# EAGLE design PCB_Plate_v6 (EAGLE 6.1)
REV: A

## Sheet 1 of 7
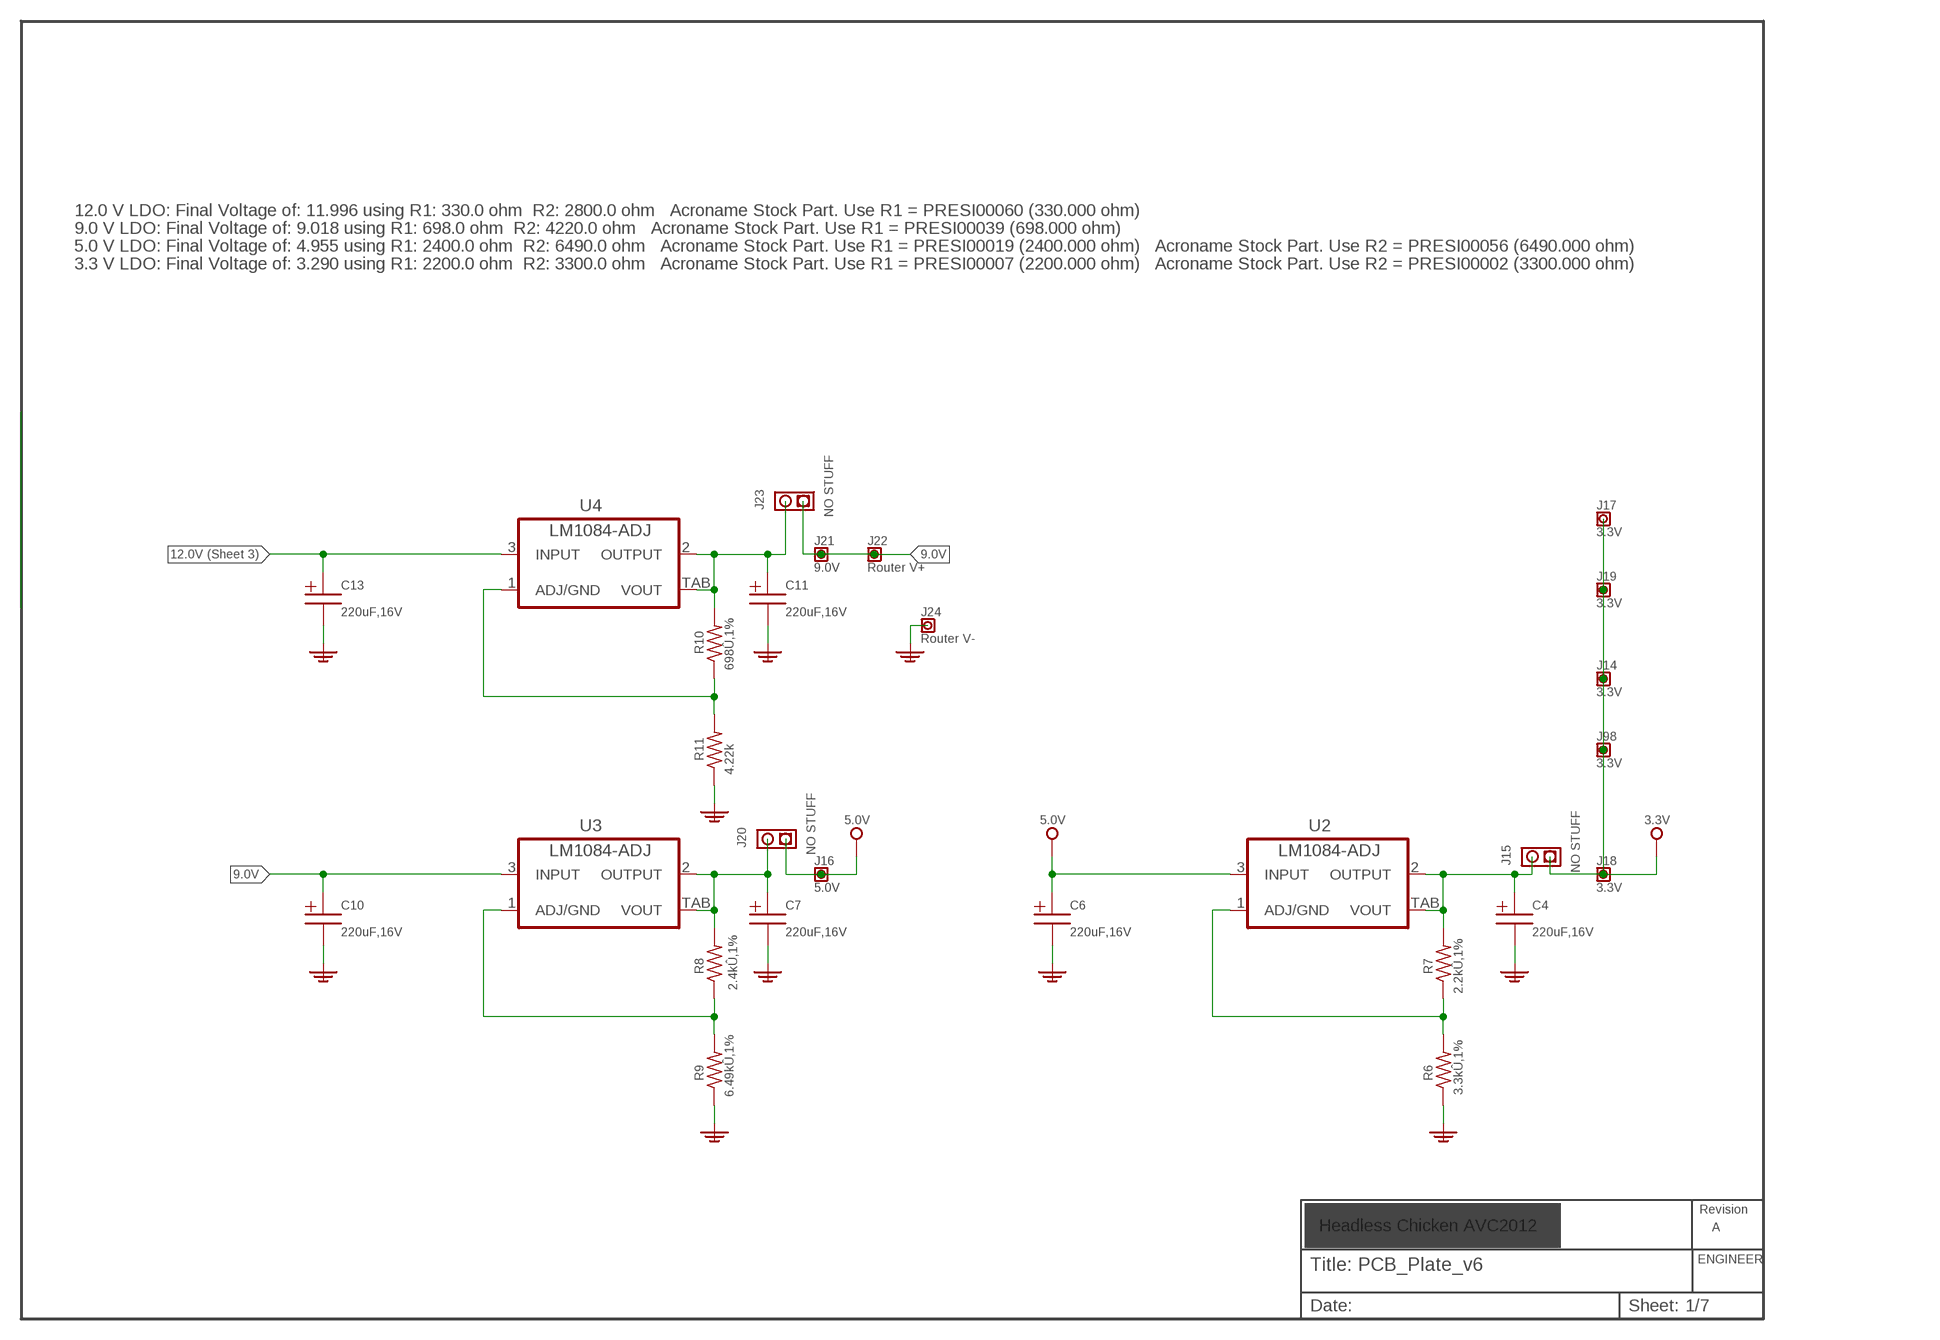
[diagram p0: schematic, sheet 1]

### Parts
C4  T491D227K016ZT  [SMC_D]
C6  T491D227K016ZT  [SMC_D]
C7  T491D227K016ZT  [SMC_D]
C10  T491D227K016ZT  [SMC_D]
C11  T491D227K016ZT  [SMC_D]
C13  T491D227K016ZT  [SMC_D]
J14  3.3V  BOARD00003WVALUE  [TSW1X1_VAL]
J15  BOARD00012  [TSW1X2]
J16  5.0V  BOARD00003WVALUE  [TSW1X1_VAL]
J17  3.3V  BOARD00003WVALUE  [TSW1X1_VAL]
J18  3.3V  BOARD00003WVALUE  [TSW1X1_VAL]
J19  3.3V  BOARD00003WVALUE  [TSW1X1_VAL]
J20  BOARD00012  [TSW1X2]
J21  9.0V  BOARD00003WVALUE  [TSW1X1_VAL]
J22  Router V+  BOARD00003WVALUE  [TSW1X1_VAL]
J23  BOARD00012  [TSW1X2]
J24  Router V-  BOARD00003WVALUE  [TSW1X1_VAL]
J98  3.3V  BOARD00003WVALUE  [TSW1X1_VAL]
R6  on  PRESI00002  [R0603]
R7  PRESI00007  [R0603]
R8  PRESI00019  [R0603]
R9  on  PRESI00056  [R0402]
R10  PRESI00039  [R0603]
R11  on  RESISTOR  [R0603]
U2  LM1084IS-ADJ  [TO263-3]
U3  LM1084IS-ADJ  [TO263-3]
U4  LM1084IS-ADJ  [TO263-3]

### Nets
3V3: J14.P$1 J15.P$1 J17.P$1 J18.P$1 J19.P$1 J98.P$1 ; also sheet 2,3,5,6,7
5V0: C6.+ J16.P$1 J20.P$1 U2.3(INPUT) ; also sheet 3,5
9.0V: C10.+ J21.P$1 J22.P$1 J23.P$1 U3.3(INPUT)
12.0V: C13.+ U4.3(INPUT) ; also sheet 3,4
GND: C4.- C6.- C7.- C10.- C11.- C13.- J24.P$1 R6.1 R9.1 R11.1 ; also sheet 2,3,4,5,6,7
N$1: R10.1 R11.2 U4.1(ADJ/GND)
N$6: R8.1 R9.2 U3.1(ADJ/GND)
N$7: R6.2 R7.1 U2.1(ADJ/GND)
N$106: C7.+ J20.P$2 R8.2 U3.2(OUTPUT) U3.TAB(VOUT)
N$107: C11.+ J23.P$2 R10.2 U4.2(OUTPUT) U4.TAB(VOUT)
N$109: C4.+ J15.P$2 R7.2 U2.2(OUTPUT) U2.TAB(VOUT)

### Notes on the sheet
- 12.0 V LDO: Final Voltage of: 11.996 using R1: 330.0 ohm  R2: 2800.0 ohm   Acroname Stock Part. Use R1 = PRESI00060 (330.000 ohm)
- 9.0 V LDO: Final Voltage of: 9.018 using R1: 698.0 ohm  R2: 4220.0 ohm   Acroname Stock Part. Use R1 = PRESI00039 (698.000 ohm)
- 5.0 V LDO: Final Voltage of: 4.955 using R1: 2400.0 ohm  R2: 6490.0 ohm   Acroname Stock Part. Use R1 = PRESI00019 (2400.000 ohm)   Acroname Stock Part. Use R2 = PRESI00056 (6490.000 ohm)
- 3.3 V LDO: Final Voltage of: 3.290 using R1: 2200.0 ohm  R2: 3300.0 ohm   Acroname Stock Part. Use R1 = PRESI00007 (2200.000 ohm)   Acroname Stock Part. Use R2 = PRESI00002 (3300.000 ohm)
- Headless Chicken AVC2012 | Headless Chicken AVC2012

## Sheet 2 of 7
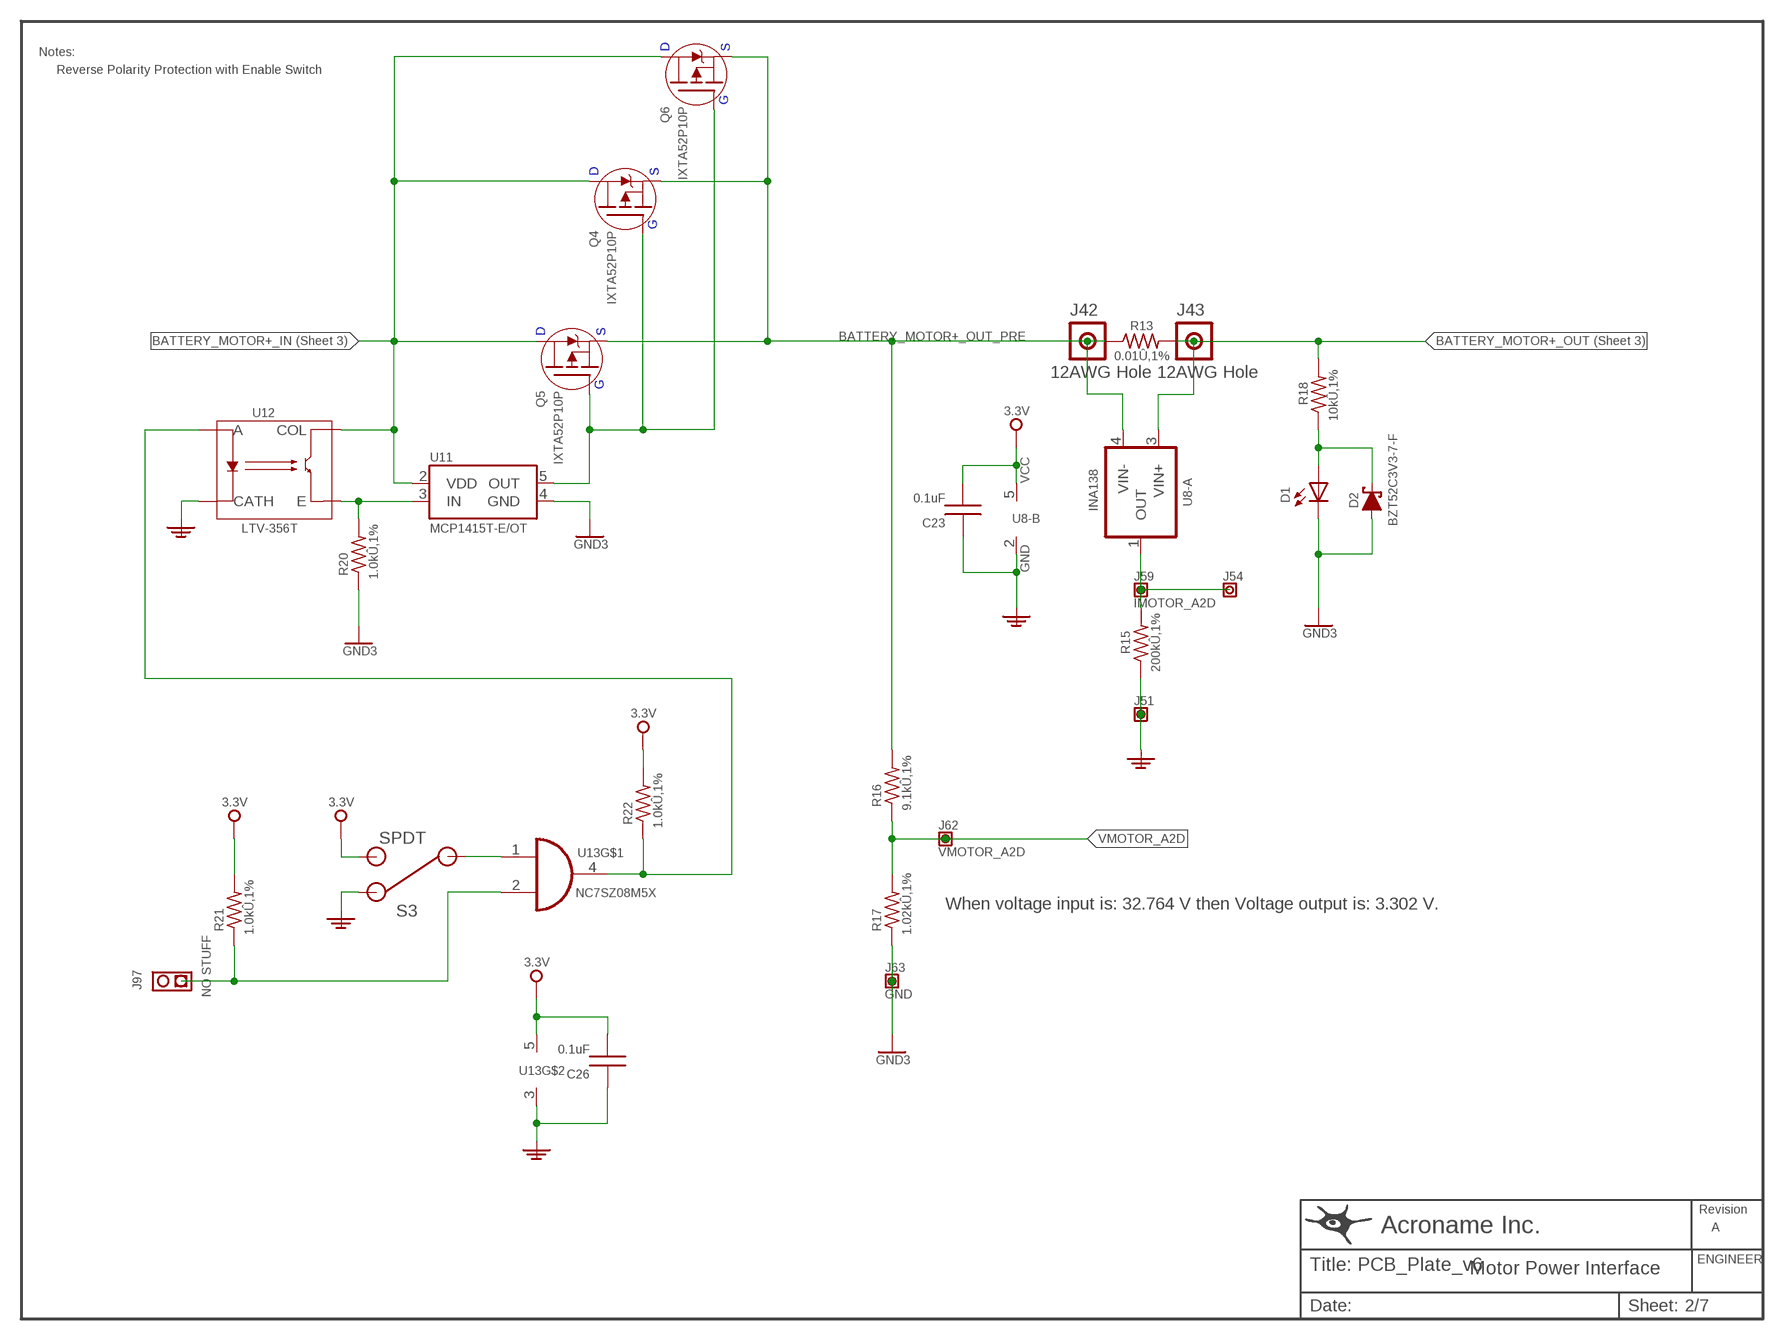
[diagram p1: schematic, sheet 2]

### Parts
C23  PCAPI00015  [C0603]
C26  PCAPI00015  [C0603]
D1  PDIOD00001  [CHIPLED_0805]
D2  BZT52C3V3-7-F  [SOD123]
J42  BOARD00008  [TSW1X1_12AWG]
J43  BOARD00008  [TSW1X1_12AWG]
J51  BOARD00003WVALUE  [TSW1X1_VAL]
J54  BOARD00003WVALUE  [TSW1X1_VAL]
J59  IMOTOR_A2D  BOARD00003WVALUE  [TSW1X1_VAL]
J62  VMOTOR_A2D  BOARD00003WVALUE  [TSW1X1_VAL]
J63  GND  BOARD00003WVALUE  [TSW1X1_VAL]
J97  BOARD00012  [TSW1X2]
Q4  IXTA52P10P  [D2PACK]
Q5  IXTA52P10P  [D2PACK]
Q6  IXTA52P10P  [D2PACK]
R13  PRESI00041  [R4527]
R15  PRESI00018  [R0603]
R16  ERJ-2RKF9101X  [R0402@1]
R17  ERJ-2RKF1021X  [R0402@1]
R18  PRESI00005  [R0603]
R20  PRESI00006  [R0603]
R21  PRESI00006  [R0603]
R22  PRESI00006  [R0603]
S3  PMISC00005  [SPDTRA]
U8  PCHIP00026  [SOT23-5]
U11  MCP1416  [SOT23-5]
U12  LTV-356T  [4-SMD]
U13  NC7SZ08M5X  [SOT23-5]

### Nets
3V3: C23.2 C26.2 R21.2 R22.2 S3.3 U8.5(-B:VCC) U13.5(VCC) ; also sheet 1,3,5,6,7
BATTERY_MOTOR+_IN: Q4.D Q5.D Q6.D U11.2(VDD) U12.4(COL) ; also sheet 3
BATTERY_MOTOR+_OUT: J43.P$1 R13.2 R18.2 U8.3(-A:VIN+) ; also sheet 3
BATTERY_MOTOR+_OUT_PRE: J42.P$1 Q4.S Q5.S Q6.S R13.1 R16.2 U8.4(-A:VIN-)
GND: C23.1 C26.1 J51.P$1 R15.1 S3.1 U8.2(-B:GND) U12.2(CATH) U13.3(GND) ; also sheet 1,3,4,5,6,7
GND3: D1.C D2.C(A) J63.P$1 R17.1 R20.1 U11.4(GND) ; also sheet 3
IMOTOR_A2D: J54.P$1 J59.P$1 R15.2 U8.1(-A:OUT)
N$3: Q4.G Q5.G Q6.G U11.5(OUT)
N$4: D1.A D2.A(C) R18.1
N$5: R22.1 U12.1(A) U13.4(O)
N$8: S3.2 U13.1(I0)
N$78: J97.P$1 R21.1 U13.2(I1)
N$79: R20.2 U11.3(IN) U12.3(E)
VMOTOR_A2D: J62.P$1 R16.1 R17.2
Unconnected: J97.P$2 S3.4 S3.5 U11.1

### Notes on the sheet
- Notes:
- Reverse Polarity Protection with Enable Switch
- When voltage input is: 32.764 V then Voltage output is: 3.302 V.
- Motor Power Interface

## Sheet 3 of 7
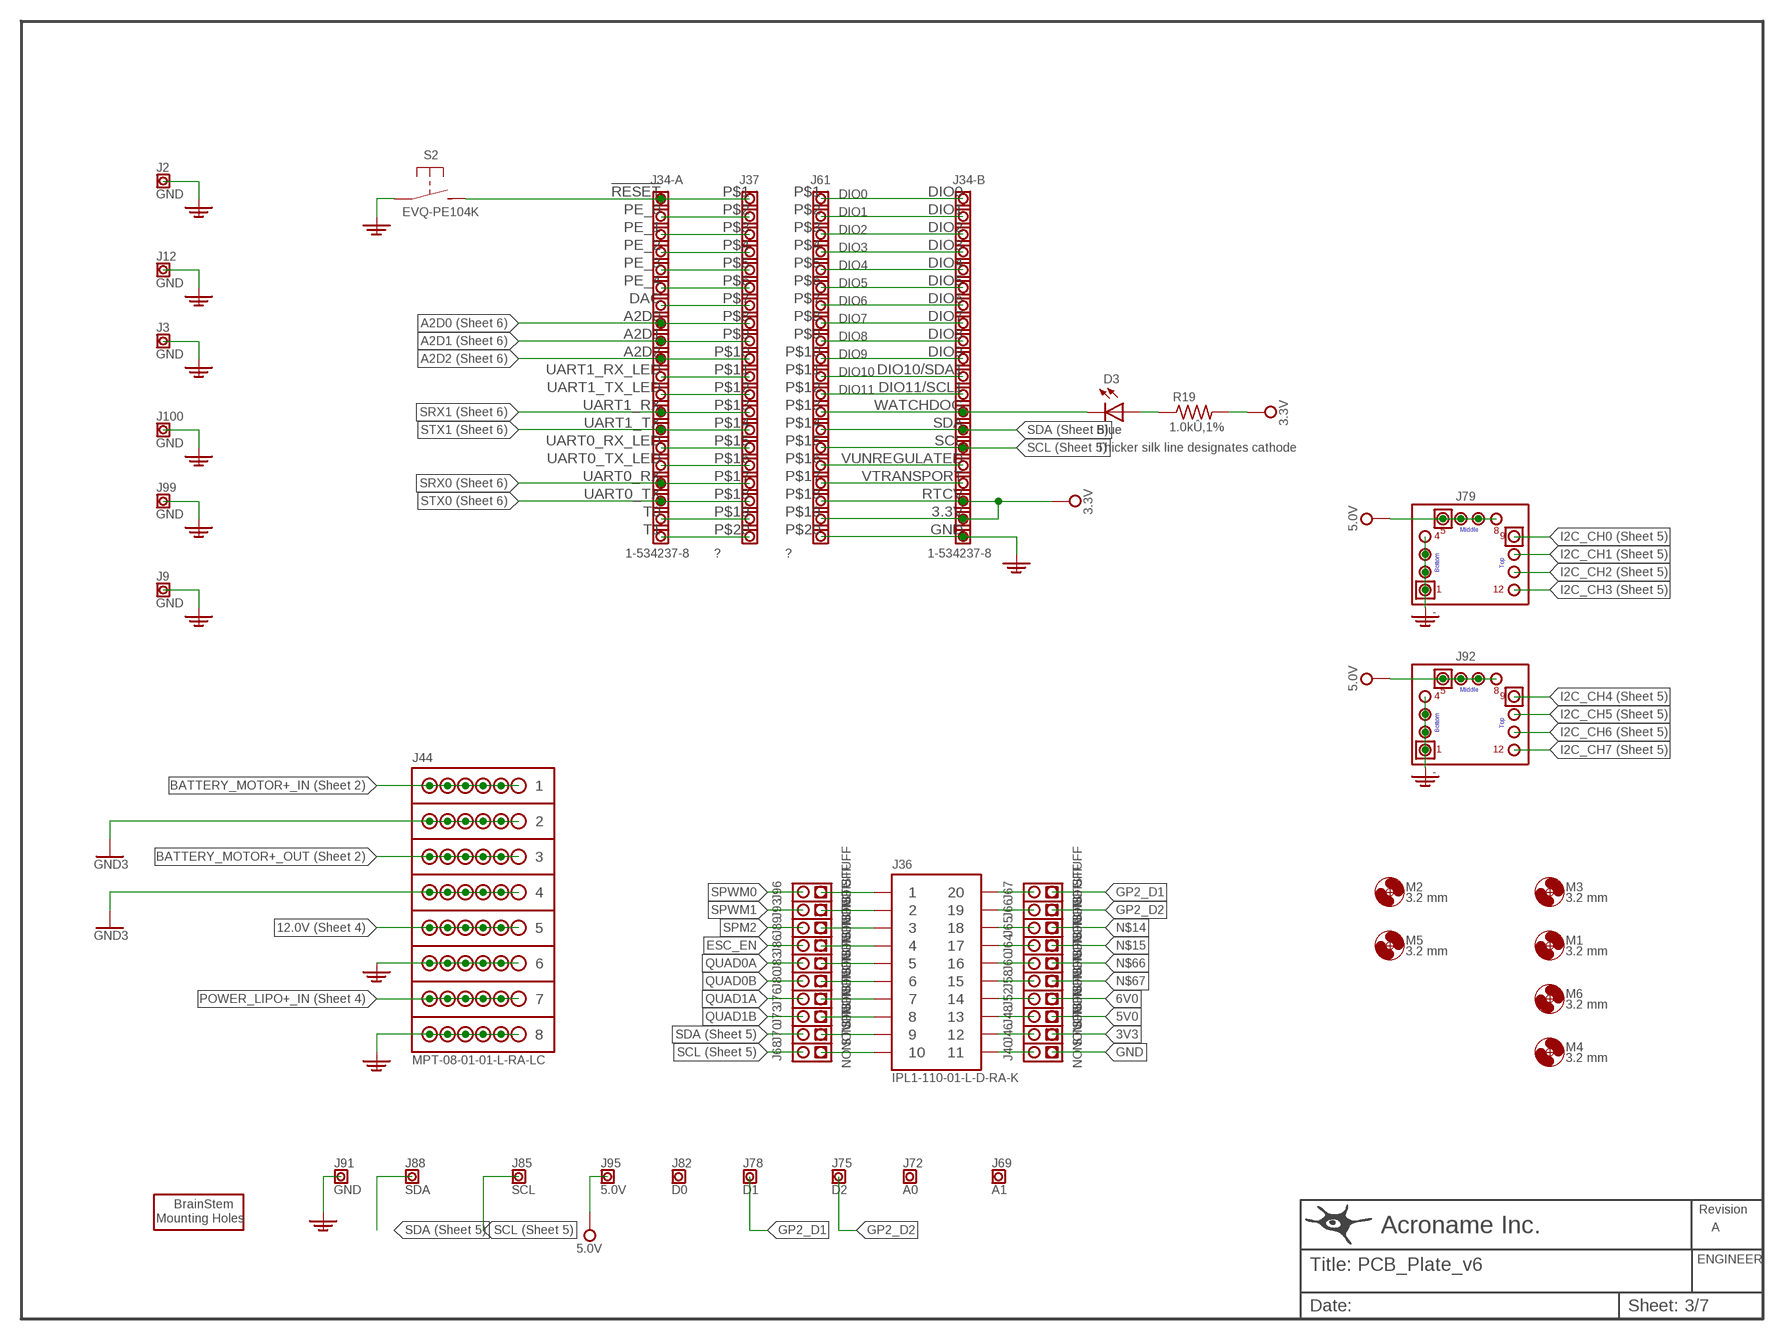
[diagram p2: schematic, sheet 3]

### Parts
D3  LTST-C171TBKT  [CHIPLED_0805]
J2  GND  BOARD00003WVALUE  [TSW1X1_VAL]
J3  GND  BOARD00003WVALUE  [TSW1X1_VAL]
J9  GND  BOARD00003WVALUE  [TSW1X1_VAL]
J12  GND  BOARD00003WVALUE  [TSW1X1_VAL]
J34  BRAINSTEMSOCKET_FEMALE  [BRAINSTEMSOCKET]
J36  IPL1-1XX-02-XXX-DH-K-XX-MKT  [IPL1-110-01-S-RA]
J37  TSW1X20  [TSW1X20]
J40  BOARD00012  [TSW1X2]
J44  MPT-08-01-01-L-RA-LC  [MPT-08-XX-X-RA-XX]
J46  BOARD00012  [TSW1X2]
J48  BOARD00012  [TSW1X2]
J52  BOARD00012  [TSW1X2]
J58  BOARD00012  [TSW1X2]
J60  BOARD00012  [TSW1X2]
J61  TSW1X20  [TSW1X20]
J64  BOARD00012  [TSW1X2]
J65  BOARD00012  [TSW1X2]
J66  BOARD00012  [TSW1X2]
J67  BOARD00012  [TSW1X2]
J68  BOARD00012  [TSW1X2]
J69  A1  BOARD00003WVALUE  [TSW1X1_VAL]
J70  BOARD00012  [TSW1X2]
J72  A0  BOARD00003WVALUE  [TSW1X1_VAL]
J73  BOARD00012  [TSW1X2]
J75  D2  BOARD00003WVALUE  [TSW1X1_VAL]
J76  BOARD00012  [TSW1X2]
J78  D1  BOARD00003WVALUE  [TSW1X1_VAL]
J79  PCONN00012  [TSW3X4RA]
J80  BOARD00012  [TSW1X2]
J82  D0  BOARD00003WVALUE  [TSW1X1_VAL]
J83  BOARD00012  [TSW1X2]
J85  SCL  BOARD00003WVALUE  [TSW1X1_VAL]
J86  BOARD00012  [TSW1X2]
J88  SDA  BOARD00003WVALUE  [TSW1X1_VAL]
J89  BOARD00012  [TSW1X2]
J91  GND  BOARD00003WVALUE  [TSW1X1_VAL]
J92  PCONN00012  [TSW3X4RA]
J93  BOARD00012  [TSW1X2]
J95  5.0V  BOARD00003WVALUE  [TSW1X1_VAL]
J96  BOARD00012  [TSW1X2]
J99  GND  BOARD00003WVALUE  [TSW1X1_VAL]
J100  GND  BOARD00003WVALUE  [TSW1X1_VAL]
M1  MOUNT-HOLE3.2  [3,2]
M2  MOUNT-HOLE3.2  [3,2]
M3  MOUNT-HOLE3.2  [3,2]
M4  MOUNT-HOLE3.2  [3,2]
M5  MOUNT-HOLE3.2  [3,2]
M6  MOUNT-HOLE3.2  [3,2]
M7  BRAINSTEM_MOUNT  [BRAINSTEM_MOUNT]
R19  PRESI00006  [R0603]
S2  EVQ-PE104K  [SPST-NO]

### Nets
3V3: J34.3.3V J34.RTCV J46.P$1 J61.P$18 J61.P$19 R19.2 ; also sheet 1,2,5,6,7
5V0: J48.P$1 J79.P$5 J79.P$6 J79.P$7 J79.P$8 J92.P$5 J92.P$6 J92.P$7 J92.P$8 J95.P$1 ; also sheet 1,5
6V0: J52.P$1
12.0V: J44.5@0 J44.5@1 J44.5@2 J44.5@3 J44.5@4 J44.5@5 ; also sheet 1,4
!RESET: J34.!RESET J37.P$1 S2.P$2(S)
A2D0: J34.A2D0 J37.P$8 ; also sheet 6
A2D1: J34.A2D1 J37.P$9 ; also sheet 6
A2D2: J34.A2D2 J37.P$10 ; also sheet 6
BATTERY_MOTOR+_IN: J44.1@0 J44.1@1 J44.1@2 J44.1@3 J44.1@4 J44.1@5 ; also sheet 2
BATTERY_MOTOR+_OUT: J44.3@0 J44.3@1 J44.3@2 J44.3@3 J44.3@4 J44.3@5 ; also sheet 2
DIO0: J34.DIO0 J61.P$1
DIO1: J34.DIO1 J61.P$2
DIO2: J34.DIO2 J61.P$3
DIO3: J34.DIO3 J61.P$4
DIO4: J34.DIO4 J61.P$5
DIO5: J34.DIO5 J61.P$6
DIO6: J34.DIO6 J61.P$7
DIO7: J34.DIO7 J61.P$8
DIO8: J34.DIO8 J61.P$9
DIO9: J34.DIO9 J61.P$10
DIO10: J34.DIO10/SDA1 J61.P$11
DIO11: J34.DIO11/SCL1 J61.P$12
ESC_EN: J86.P$2
GND: J2.P$1 J3.P$1 J9.P$1 J12.P$1 J34.GND J40.P$1 J44.6@0 J44.6@1 J44.6@2 J44.6@3 J44.6@4 J44.6@5 J44.8@0 J44.8@1 J44.8@2 J44.8@3 J44.8@4 J44.8@5 J61.P$20 J79.P$1 J79.P$2 J79.P$3 J79.P$4 J91.P$1 J92.P$1 J92.P$2 J92.P$3 J92.P$4 J99.P$1 J100.P$1 S2.P$1(P) ; also sheet 1,2,4,5,6,7
GND3: J44.2@0 J44.2@1 J44.2@2 J44.2@3 J44.2@4 J44.2@5 J44.4@0 J44.4@1 J44.4@2 J44.4@3 J44.4@4 J44.4@5 ; also sheet 2
GP2_D1: J67.P$1 J78.P$1
GP2_D2: J66.P$1 J75.P$1
I2C_CH0: J79.P$9 ; also sheet 5
I2C_CH1: J79.P$10 ; also sheet 5
I2C_CH2: J79.P$11 ; also sheet 5
I2C_CH3: J79.P$12 ; also sheet 5
I2C_CH4: J92.P$9 ; also sheet 5
I2C_CH5: J92.P$10 ; also sheet 5
I2C_CH6: J92.P$11 ; also sheet 5
I2C_CH7: J92.P$12 ; also sheet 5
N$9: D3.A R19.1
N$12: D3.C J34.WATCHDOG J61.P$13
N$14: J65.P$1
N$15: J64.P$1
N$16: J34.PE_0 J37.P$2
N$17: J34.PE_1 J37.P$3
N$18: J34.PE_2 J37.P$4
N$19: J34.PE_3 J37.P$5
N$20: J34.PE_4 J37.P$6
N$21: J34.DAC J37.P$7
N$22: J34.UART1_RX_LED J37.P$11
N$23: J34.UART1_TX_LED J37.P$12
N$26: J34.UART0_RX_LED J37.P$15
N$27: J34.UART0_TX_LED J37.P$16
N$30: J34.T0 J37.P$19
N$31: J34.T1 J37.P$20
N$44: J34.VTRANSPORT J61.P$17
N$46: J36.1 J96.P$1
N$56: J36.2 J93.P$1
N$57: J36.3 J89.P$1
N$59: J36.4 J86.P$1
N$60: J36.5 J83.P$1
N$61: J36.6 J80.P$1
N$62: J36.7 J76.P$1
N$63: J36.8 J73.P$1
N$64: J36.9 J70.P$1
N$65: J36.10 J68.P$1
N$66: J60.P$1
N$67: J58.P$1
N$68: J36.20 J67.P$2
N$69: J36.19 J66.P$2
N$70: J36.18 J65.P$2
N$71: J36.17 J64.P$2
N$72: J36.16 J60.P$2
N$73: J36.15 J58.P$2
N$74: J36.14 J52.P$2
N$75: J36.13 J48.P$2
N$76: J36.12 J46.P$2
N$77: J36.11 J40.P$2
N$80: J34.VUNREGULATED J61.P$16
POWER_LIPO+_IN: J44.7@0 J44.7@1 J44.7@2 J44.7@3 J44.7@4 J44.7@5 ; also sheet 4
QUAD0A: J83.P$2
QUAD0B: J80.P$2
QUAD1A: J76.P$2
QUAD1B: J73.P$2
SCL: J34.SCL J61.P$15 J68.P$2 J85.P$1 ; also sheet 5,6,7
SDA: J34.SDA J61.P$14 J70.P$2 J88.P$1 ; also sheet 5,6,7
SPM2: J89.P$2
SPWM0: J96.P$2
SPWM1: J93.P$2
SRX0: J34.UART0_RX J37.P$17 ; also sheet 6
SRX1: J34.UART1_RX J37.P$13 ; also sheet 6
STX0: J34.UART0_TX J37.P$18 ; also sheet 6
STX1: J34.UART1_TX J37.P$14 ; also sheet 6
Unconnected: J69.P$1 J72.P$1 J82.P$1

## Sheet 4 of 7
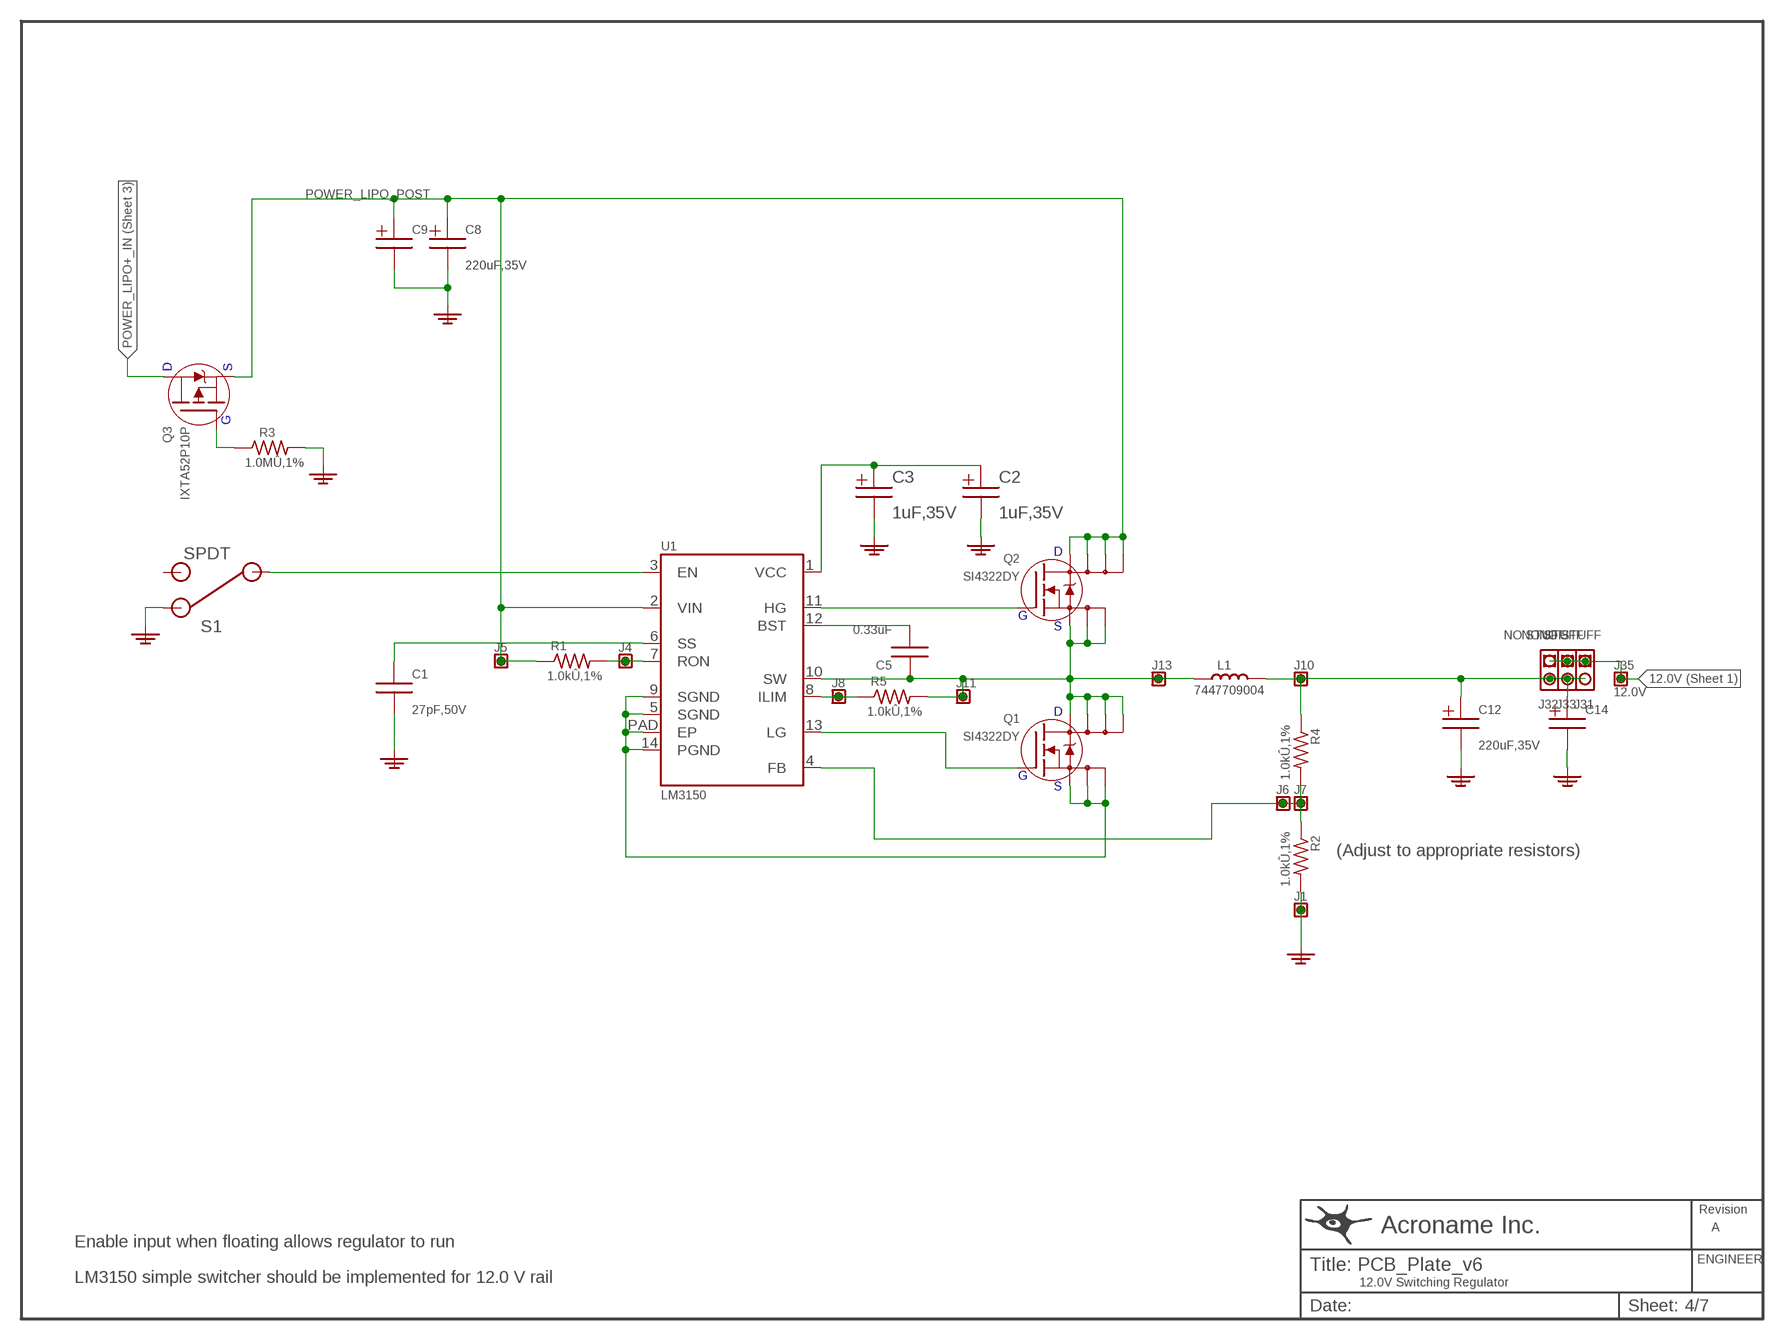
[diagram p3: schematic, sheet 4]
FRAME4 (LETTER_L): DESCRIPTION: 12.0V Switching Regulator

### Parts
C1  ECJ-1VC1H270J  [C0603]
C2  T491B105K035AT  [T491]
C3  T491B105K035AT  [T491]
C5  PCAPI00005  [C0603]
C8  PCAPI00020  [PANASONIC_G]
C9  CAP_POLARIZED  [PANASONIC_NHG_A]
C12  PCAPI00020  [PANASONIC_G]
C14  CAP_POLARIZED  [PANASONIC_NHG_A]
J1  BOARD00003  [TSW1X1]
J4  BOARD00003  [TSW1X1]
J5  BOARD00003  [TSW1X1]
J6  BOARD00003  [TSW1X1]
J7  BOARD00003  [TSW1X1]
J8  BOARD00003  [TSW1X1]
J10  BOARD00003  [TSW1X1]
J11  BOARD00003  [TSW1X1]
J13  BOARD00003  [TSW1X1]
J31  BOARD00012  [TSW1X2]
J32  BOARD00012  [TSW1X2]
J33  BOARD00012  [TSW1X2]
J35  12.0V  BOARD00003WVALUE  [TSW1X1_VAL]
L1  7447709004  [7447709004]
Q1  SI4322DY  [SO-08]
Q2  SI4322DY  [SO-08]
Q3  IXTA52P10P  [D2PACK]
R1  PRESI00006  [R0603]
R2  PRESI00006  [R0603]
R3  ERJ-3EKF1004V  [R0603]
R4  PRESI00006  [R0603]
R5  PRESI00006  [R0603]
S1  PMISC00005  [SPDTRA]
U1  LM3150  [TSSOP14EXP]

### Nets
12.0V: J31.P$1 J32.P$1 J33.P$1 J35.P$1 ; also sheet 1,3
GND: C1.2 C2.- C3.- C8.- C9.- C12.- C14.- J1.P$1 R2.2 R3.2 S1.1 ; also sheet 1,2,3,5,6,7
N$2: S1.2 U1.3(EN)
N$42: C12.+ C14.+ J10.P$1 J31.P$2 J32.P$2 J33.P$2 L1.2 R4.1
N$45: C2.+ C3.+ U1.1(VCC)
N$47: Q1.1(SA) Q1.2(SB) Q1.3(SC) U1.5(SGND) U1.9(SGND) U1.14(PGND) U1.PAD(EP)
N$48: Q1.4(G) U1.13(LG)
N$49: Q2.4(G) U1.11(HG)
N$50: Q3.G R3.1
N$51: J4.P$1 R1.2 U1.7(RON)
N$52: C5.1 J11.P$1 J13.P$1 L1.1 Q1.5(DA) Q1.6(DB) Q1.7(DC) Q1.8(DD) Q2.1(SA) Q2.2(SB) Q2.3(SC) R5.2 U1.10(SW)
N$53: C5.2 U1.12(BST)
N$54: J6.P$1 J7.P$1 R2.1 R4.2 U1.4(FB)
N$55: J8.P$1 R5.1 U1.8(ILIM)
N$58: C1.1 U1.6(SS)
POWER_LIPO+_IN: Q3.D ; also sheet 3
POWER_LIPO_POST: C8.+ C9.+ J5.P$1 Q2.5(DA) Q2.6(DB) Q2.7(DC) Q2.8(DD) Q3.S R1.1 U1.2(VIN)
Unconnected: S1.3 S1.4 S1.5

### Notes on the sheet
- (Adjust to appropriate resistors)
- Enable input when floating allows regulator to run
- LM3150 simple switcher should be implemented for 12.0 V rail

## Sheet 5 of 7
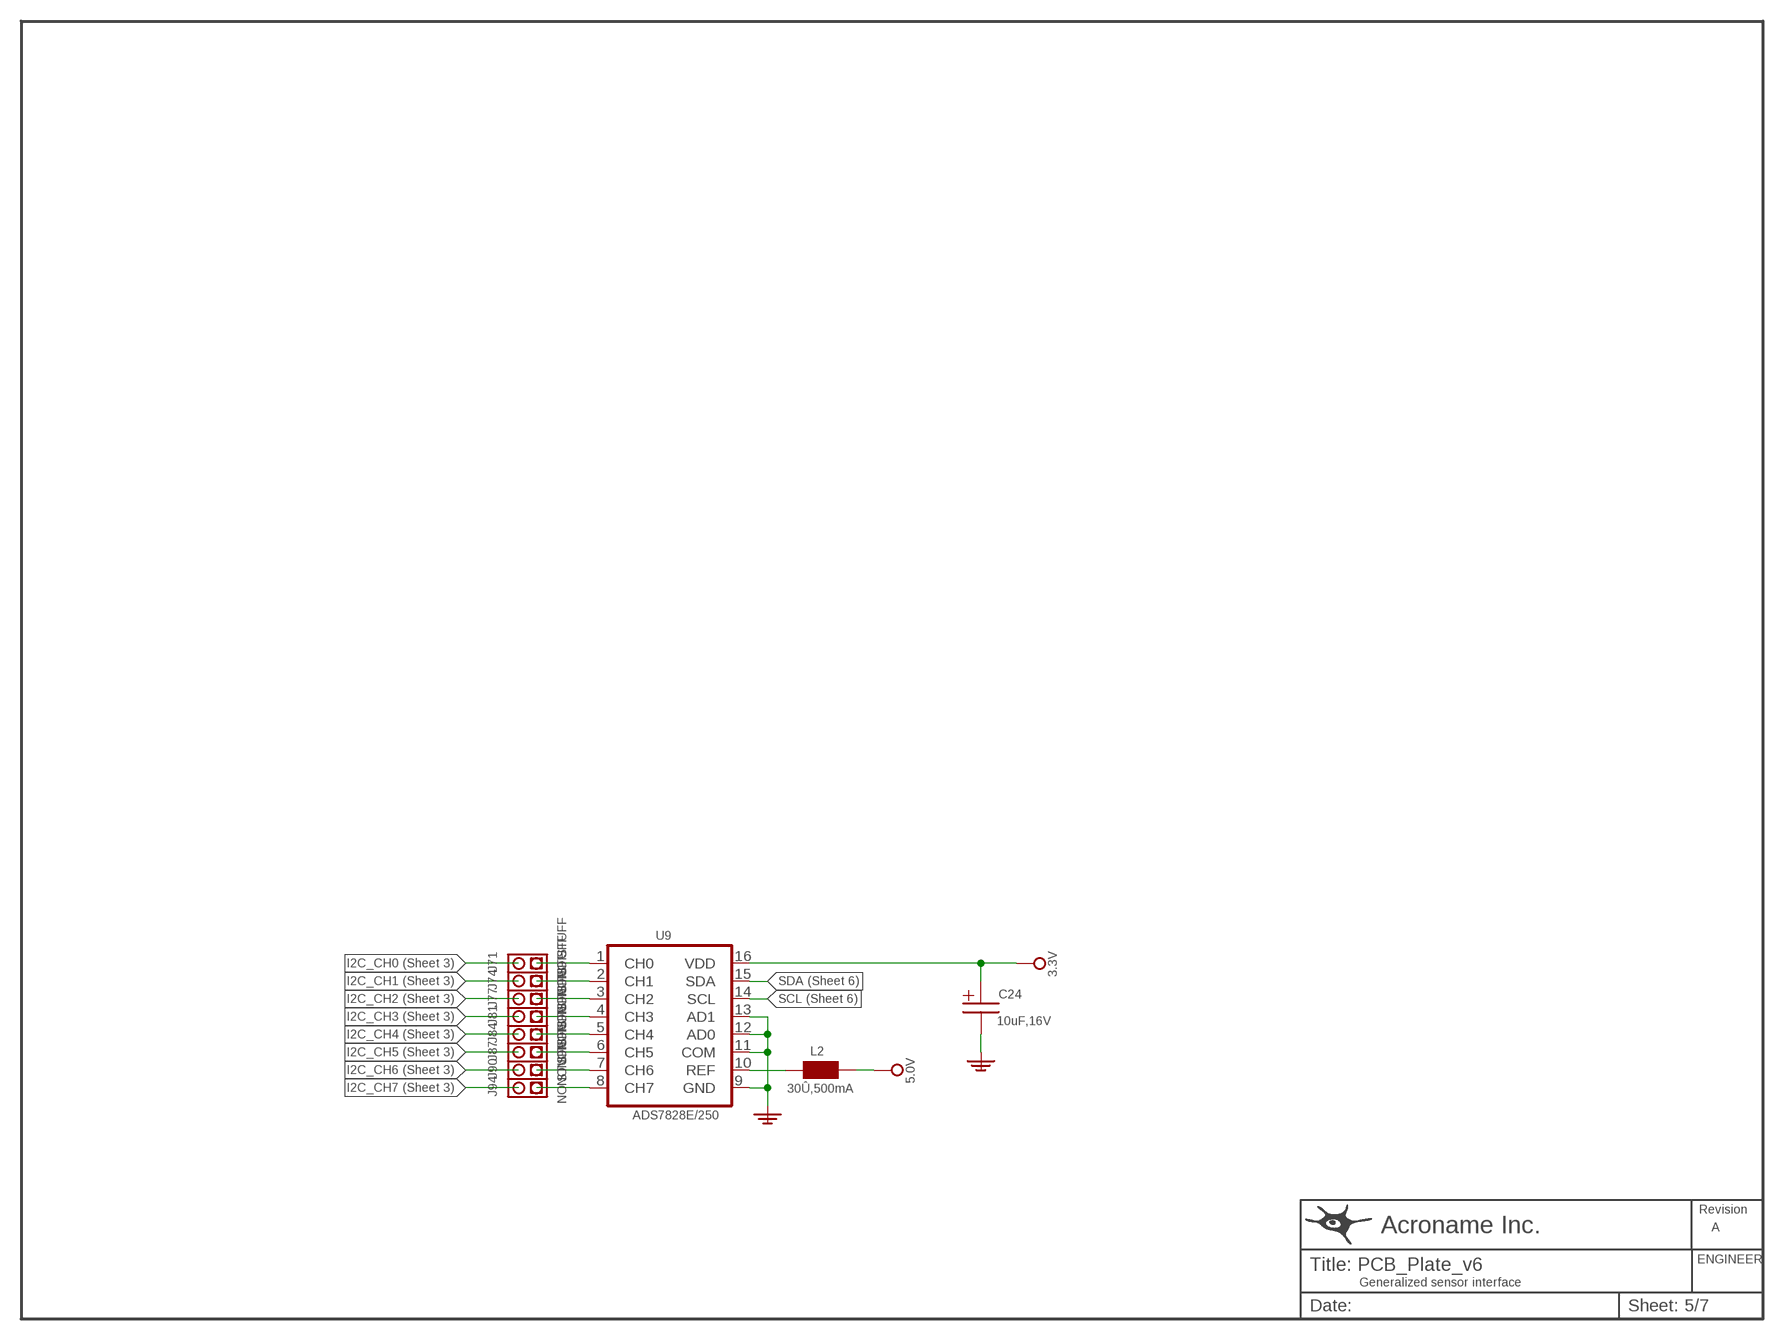
[diagram p4: schematic, sheet 5]
FRAME5 (LETTER_L): DESCRIPTION: Generalized sensor interface

### Parts
C24  T491A106K010AT  [SMC_A]
J71  BOARD00012  [TSW1X2]
J74  BOARD00012  [TSW1X2]
J77  BOARD00012  [TSW1X2]
J81  BOARD00012  [TSW1X2]
J84  BOARD00012  [TSW1X2]
J87  BOARD00012  [TSW1X2]
J90  BOARD00012  [TSW1X2]
J94  BOARD00012  [TSW1X2]
L2  PMISC00013  [L0402]
U9  ADS7828E  [TSSOP16]

### Nets
3V3: C24.+ U9.16(VDD) ; also sheet 1,2,3,6,7
5V0: L2.2 ; also sheet 1,3
GND: C24.- U9.9(GND) U9.11(COM) U9.12(AD0) U9.13(AD1) ; also sheet 1,2,3,4,6,7
I2C_CH0: J71.P$2 ; also sheet 3
I2C_CH1: J74.P$2 ; also sheet 3
I2C_CH2: J77.P$2 ; also sheet 3
I2C_CH3: J81.P$2 ; also sheet 3
I2C_CH4: J84.P$2 ; also sheet 3
I2C_CH5: J87.P$2 ; also sheet 3
I2C_CH6: J90.P$2 ; also sheet 3
I2C_CH7: J94.P$2 ; also sheet 3
N$25: J71.P$1 U9.1(CH0)
N$41: L2.1 U9.10(REF)
N$87: J74.P$1 U9.2(CH1)
N$90: J77.P$1 U9.3(CH2)
N$91: J81.P$1 U9.4(CH3)
N$96: J84.P$1 U9.5(CH4)
N$97: J87.P$1 U9.6(CH5)
N$98: J90.P$1 U9.7(CH6)
N$99: J94.P$1 U9.8(CH7)
SCL: U9.14(SCL) ; also sheet 3,6,7
SDA: U9.15(SDA) ; also sheet 3,6,7

## Sheet 6 of 7
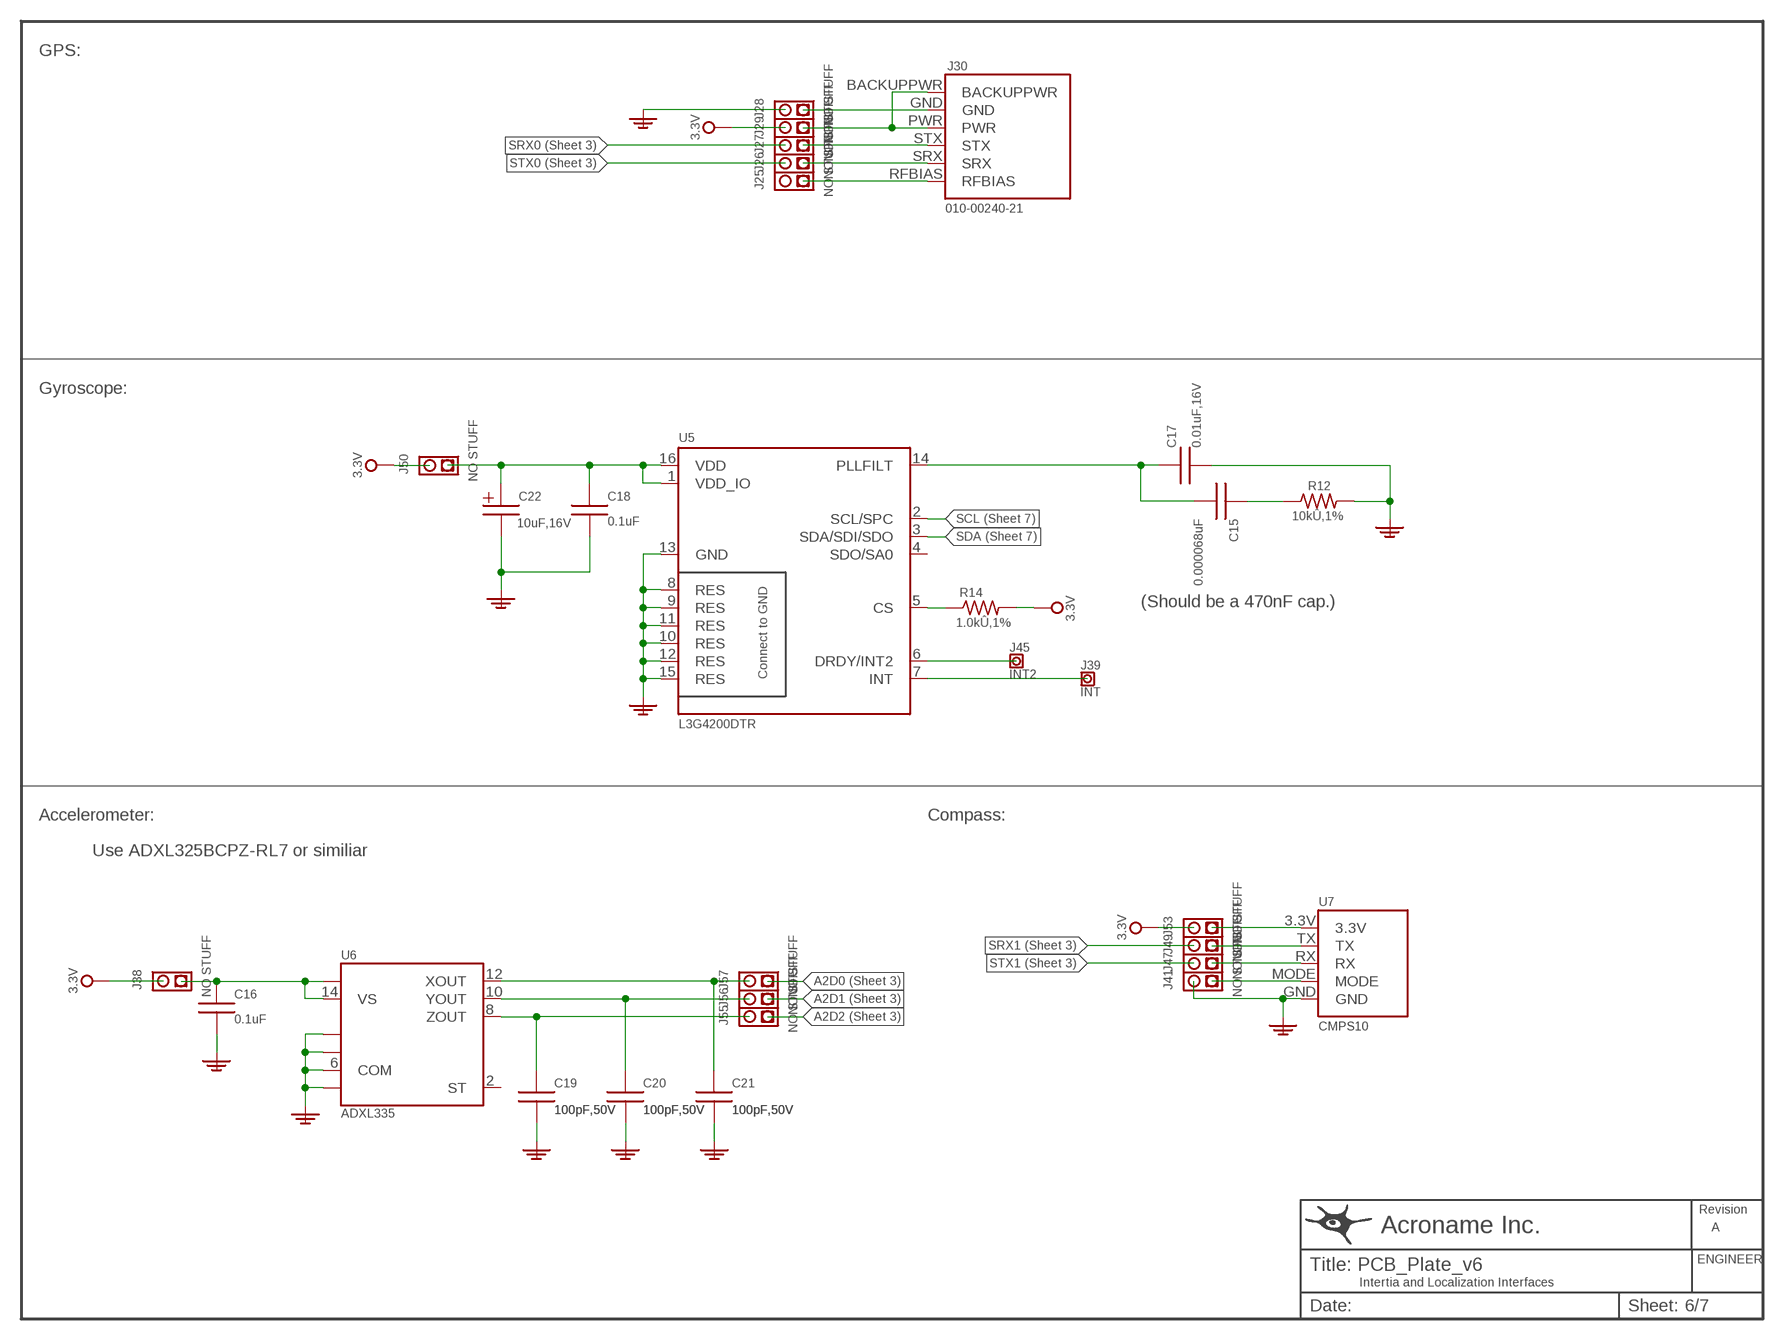
[diagram p5: schematic, sheet 6]
FRAME6 (LETTER_L): DESCRIPTION: Intertia and Localization Interfaces

### Parts
C15  PCAPI00023  [C0603]
C16  PCAPI00015  [C0603]
C17  PCAPI00007  [C0603]
C18  PCAPI00015  [C0603]
C19  PCAPI00016  [C0603]
C20  PCAPI00016  [C0603]
C21  PCAPI00016  [C0603]
C22  T491A106K010AT  [SMC_A]
J25  BOARD00012  [TSW1X2]
J26  BOARD00012  [TSW1X2]
J27  BOARD00012  [TSW1X2]
J28  BOARD00012  [TSW1X2]
J29  BOARD00012  [TSW1X2]
J30  GPS15X  [GPS15]
J38  BOARD00012  [TSW1X2]
J39  INT  BOARD00003WVALUE  [TSW1X1_VAL]
J41  BOARD00012  [TSW1X2]
J45  INT2  BOARD00003WVALUE  [TSW1X1_VAL]
J47  BOARD00012  [TSW1X2]
J49  BOARD00012  [TSW1X2]
J50  BOARD00012  [TSW1X2]
J53  BOARD00012  [TSW1X2]
J55  BOARD00012  [TSW1X2]
J56  BOARD00012  [TSW1X2]
J57  BOARD00012  [TSW1X2]
R12  PRESI00005  [R0603]
R14  PRESI00006  [R0603]
U5  L3G4200DTR  [LGA16]
U6  ADXL335  [LFCSP-16]
U7  CMPS10  [CMPS10]

### Nets
3V3: J29.P$2 J38.P$2 J50.P$2 J53.P$2 R14.2 ; also sheet 1,2,3,5,7
A2D0: J57.P$1 ; also sheet 3
A2D1: J56.P$1 ; also sheet 3
A2D2: J55.P$1 ; also sheet 3
GND: C16.2 C17.2 C18.2 C19.2 C20.2 C21.2 C22.- J28.P$2 J41.P$2 R12.2 U5.8(RES) U5.9(RES) U5.10(RES) U5.11(RES) U5.12(RES) U5.13(GND) U5.15(RES) U6.3(COM) U6.5(COM) U6.6(COM) U6.7(COM) U7.GND ; also sheet 1,2,3,4,5,7
N$24: J41.P$1 U7.MODE
N$28: C18.1 C22.+ J50.P$1 U5.1(VDD_IO) U5.16(VDD)
N$29: R14.1 U5.5(CS)
N$32: J29.P$1 J30.BACKUPPWR J30.PWR
N$33: J28.P$1 J30.GND
N$34: J27.P$1 J30.STX
N$35: J26.P$1 J30.SRX
N$36: J25.P$1 J30.RFBIAS
N$37: C15.2 C17.1 U5.14(PLLFILT)
N$38: C15.1 R12.1
N$39: J39.P$1 U5.7(INT)
N$40: J45.P$1 U5.6(DRDY/INT2)
N$43: J53.P$1 U7.3.3V
N$85: J49.P$1 U7.TX
N$86: J47.P$1 U7.RX
N$100: C16.1 J38.P$1 U6.14(VS) U6.15(VS)
N$103: C19.1 J55.P$2 U6.8(ZOUT)
N$110: C20.1 J56.P$2 U6.10(YOUT)
N$111: C21.1 J57.P$2 U6.12(XOUT)
SCL: U5.2(SCL/SPC) ; also sheet 3,5,7
SDA: U5.3(SDA/SDI/SDO) ; also sheet 3,5,7
SRX0: J27.P$2 ; also sheet 3
SRX1: J49.P$2 ; also sheet 3
STX0: J26.P$2 ; also sheet 3
STX1: J47.P$2 ; also sheet 3
Unconnected: J25.P$2 U5.4(SDO/SA0) U6.2(ST)

### Notes on the sheet
- GPS:
- Gyroscope:
- (Should be a 470nF cap.)
- Accelerometer: | Compass:
- Use ADXL325BCPZ-RL7 or similiar

## Sheet 7 of 7
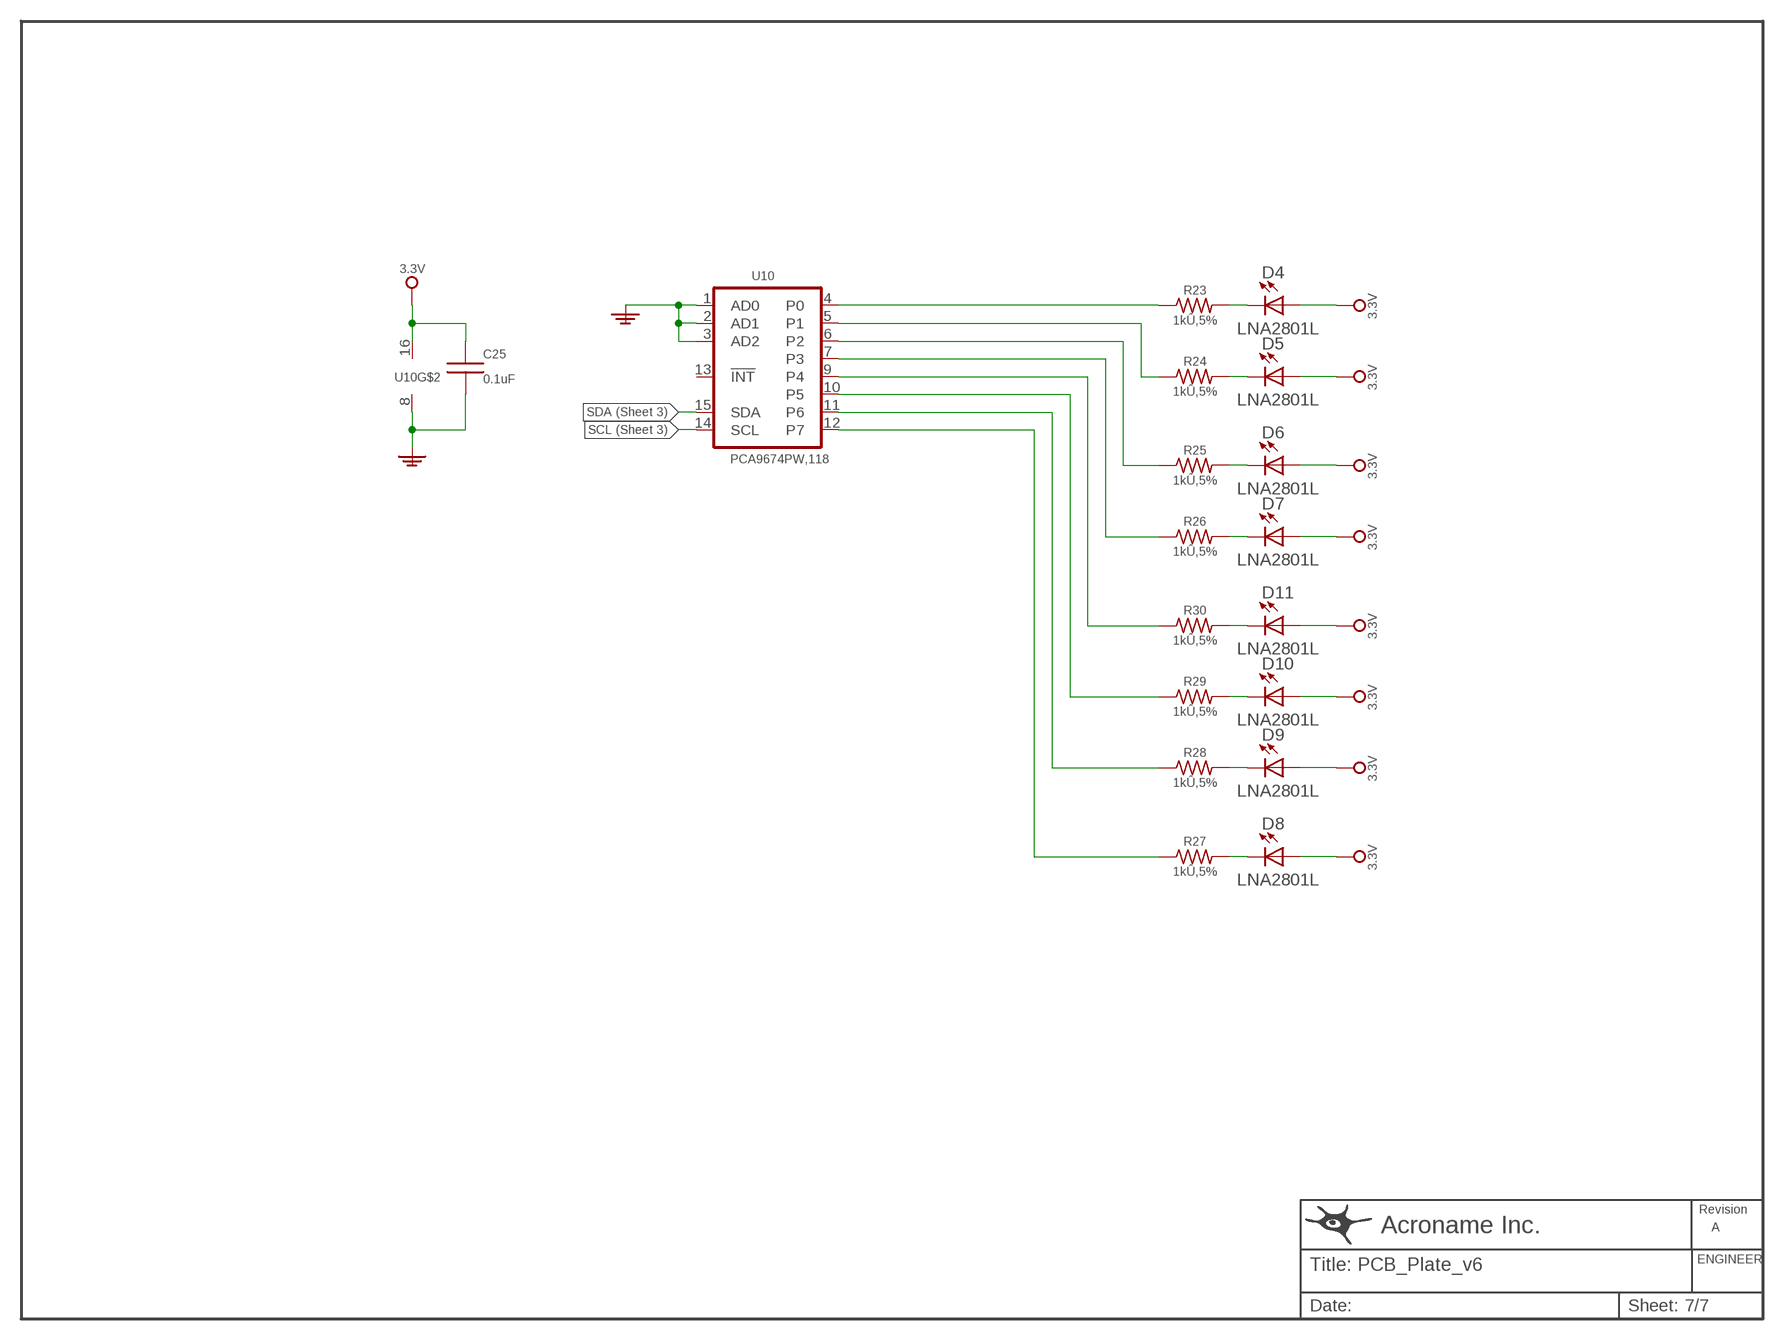
[diagram p6: schematic, sheet 7]

### Parts
C25  PCAPI00015  [C0603]
D4  PDIOD00003  [LT3LR1N02-001]
D5  PDIOD00003  [LT3LR1N02-001]
D6  PDIOD00003  [LT3LR1N02-001]
D7  PDIOD00003  [LT3LR1N02-001]
D8  PDIOD00003  [LT3LR1N02-001]
D9  PDIOD00003  [LT3LR1N02-001]
D10  PDIOD00003  [LT3LR1N02-001]
D11  PDIOD00003  [LT3LR1N02-001]
R23  PRESI00012  [CFR-12]
R24  PRESI00012  [CFR-12]
R25  PRESI00012  [CFR-12]
R26  PRESI00012  [CFR-12]
R27  PRESI00012  [CFR-12]
R28  PRESI00012  [CFR-12]
R29  PRESI00012  [CFR-12]
R30  PRESI00012  [CFR-12]
U10  I2C_DIO_EXPANDER  [TSSOP16]

### Nets
3V3: C25.1 D4.A D5.A D6.A D7.A D8.A D9.A D10.A D11.A U10.16(VCC) ; also sheet 1,2,3,5,6
GND: C25.2 U10.1(AD0) U10.2(AD1) U10.3(AD2) U10.8(GND) ; also sheet 1,2,3,4,5,6
N$13: D4.C R23.P$2
N$81: R23.P$1 U10.4(P0)
N$82: D5.C R24.P$2
N$83: D6.C R25.P$2
N$84: D7.C R26.P$2
N$88: D11.C R30.P$2
N$89: D10.C R29.P$2
N$92: D9.C R28.P$2
N$93: D8.C R27.P$2
N$94: R24.P$1 U10.5(P1)
N$95: R25.P$1 U10.6(P2)
N$101: R26.P$1 U10.7(P3)
N$102: R30.P$1 U10.9(P4)
N$104: R29.P$1 U10.10(P5)
N$105: R28.P$1 U10.11(P6)
N$108: R27.P$1 U10.12(P7)
SCL: U10.14(SCL) ; also sheet 3,5,6
SDA: U10.15(SDA) ; also sheet 3,5,6
Unconnected: U10.13(!INT)

## Library data of the parts
C1 = aAcroname:ECJ-1VC1H270J: 0.000027 UF 50V CERAMIC; ACRONAME: PCAPI00028; PARTNUM: ECJ-1VC1H270J
C2 C3 = aAcroname:T491B105K035AT: 1.0UF 35V +/-10% TANTALUM
C4 C6 C7 C10 C11 C13 = aAcroname:T491D227K016ZT: 220 UF 16V +/-10% Tantalum; ACRONAME: PCAPI00037; CAPACITANCE: 220uF,16V; PARTNUM: T491D227K016ZT; UNITCOST: 0.99
C5 = aAcroname:PCAPI00005: 0.33UF 10V CERAMIC
C8 C12 = aAcroname:PCAPI00020: 220UF 35V ELECTROLYTIC LOW ESR +/-20%; ACRONAME: PCAPI00020; PARTNUM: EEETG1V221UP; UNITCOST: ?
C9 C14 = aAcroname:CAP_POLARIZED: Polarized Capacitor; ACRONAME: -; CAPACITANCE: ?
C15 = aAcroname:PCAPI00023: 0.000068UF 50V CERAMIC +/-5%
C16 C18 C23 C25 C26 = aAcroname:PCAPI00015: 0.1UF 25V CERAMIC X7R +/-10%; ACRONAME: PCAPI00015; PARTNUM: ECJ-1VB1E104K
C17 = aAcroname:PCAPI00007: 0.01UF 16V CERAMIC X7R +/-10%; ACRONAME: PCAPI00007; PARTNUM: ECJ-1VB1C103K
C19-C21 = aAcroname:PCAPI00016: 0.0001UF 50V CERAMIC X7R +/-10%; ACRONAME: PCAPI00016; PARTNUM: ECJ-1VC1H101J
C22 C24 = aAcroname:T491A106K010AT: 10UF 16V TANTALUM +/-10%; ACRONAME: PCAPI00032; PARTNUM: T491A106M016AT; UNITCOST: 0.093
D1 = aAcroname:PDIOD00001: LED SMT Red 0805; ACRONAME: PDIOD00001; COLOR: Red; NOTES: Thicker silk line designates cathode; PARTNUM: LTST-C171CKT; UNITCOST: 0.06
D2 = aAcroname:BZT52C3V3-7-F: DIODE ZENER Vz=3.3V 500mW; ACRONAME: -; PARTNUM: BZT52C3V3-7-F
D3 = aAcroname:LTST-C171TBKT: LED SMT Blue 0805; ACRONAME: PDIOD00013; NOTES: Thicker silk line designates cathode; PARTNUM: LTST-C171TBKT; UNITCOST: 0.31
D4-D11 = aAcroname:PDIOD00003: IR LED 940NM 15 DEG T1
J1 J4-J8 J10 J11 J13 = aAcroname:BOARD00003: Through hole for 22AWG wire; ACRONAME: -; ASSEMBLY: DNI; PARTNUM: -
J2 J3 J9 J12 J14 J16-J19 J21 J22 J24 J35 J39 J45 J51 J54 J59 J62 J63 J69 J72 J75 J78 J82 J85 J88 J91 J95 J98-J100 = aAcroname:BOARD00003: Through hole for 22AWG wire; ACRONAME: -; ASSEMBLY: No Stuff; PARTNUM: -; UNITCOST: 0.0
J15 J20 J23 J25-J29 J31-J33 J38 J40 J41 J46-J50 J52 J53 J55-J58 J60 J64-J68 J70 J71 J73 J74 J76 J77 J80 J81 J83 J84 J86 J87 J89 J90 J93 J94 J96 J97 = aAcroname:BOARD00012: Jumper for shorting connections 0.1 inch spacing; ACRONAME: -; NOTES: NO STUFF; PARTNUM: -
J30 = avc:GPS15X: Garmin GPS OEM; PARTNUM: 010-00240-21
J34 = aAcroname:BRAINSTEMSOCKET_FEMALE: 0.1 inch female header pair for interfacing socket.; ACRONAME: PCONN00082; ALTERNATIVE: SSW-120-01-G-S:75915-320LF; PARTNUM: 1-534237-8
J36 = avc:IPL1-1XX-02-XXX-DH-K-XX-MKT: Terminal Header 2x10 Right Angle; PARTNUM: IPL1-110-01-L-D-RA-K
J37 J61 = aAcroname:TSW1X20: 0.1 inch 1x20 header; ACRONAME: -; PARTNUM: ?; UNITCOST: ?
J42 J43 = aAcroname:BOARD00008: Through hole for 12AWG wire.
J44 = avc:MPT-08-01-01-L-RA-LC: Samtec PowerStrip/25 8 position terminal; PARTNUM: MPT-08-01-01-L-RA-LC
J79 J92 = aAcroname:PCONN00012: Samtec Right Angle 3X4 Header; ACRONAME: PCONN00012; PARTNUM: -; UNITCOST: 0.53
L1 = avc:7447709004: INDUCTOR POWER 4.7UH 9.3A; PARTNUM: 7447709004
L2 = aAcroname:PMISC00013: FERRITE CHIP SIGNAL 30 OHM 500mA 0402; ACRONAME: PMISC00013; PARTNUM: LI0402E300R-10; UNITCOST: 0.05
M1-M6 = aAcroname:MOUNT-HOLE: Mounting hole with drill center marker; ACRONAME: -; PARTNUM: -; SIZE: 3.2 mm
M7 = avc:BRAINSTEM_MOUNT: BrainStem mounting holes; ACRONAME: -; NOTES: No Stuff; PARTNUM: -
Q1 Q2 = aAcroname:SI4322DY: MOSFET N-Channel 30V w/ Schottky; ACRONAME: PMISC00036; PARTNUM: SI4322DY; UNITCOST: 0.95
Q3 Q5 = aAcroname:IXTA52P10P: MOSFET P-CH 100V 52A; ACRONAME: PMISC00034; PARTNUM: IXTA52P10P; UNITCOST: 2.65
Q4 Q6 = aAcroname:IXTA52P10P: MOSFET P-CH 100V 52A; ACRONAME: PMISC00034; NOTES: No Stuff; PARTNUM: IXTA52P10P; UNITCOST: 2.65
R1 R2 R4 R5 R14 R19-R22 = aAcroname:PRESI00006: 1.0K OHM 1/10W +/-1%; ACRONAME: PRESI00006; PARTNUM: ERJ-3EKF1001V; RESISTANCE: 1.0kÛ,1%; UNITCOST: 0.006
R3 = aAcroname:ERJ-3EKF1004V: 1.0M OHM 1/10W +/-1%; ACRONAME: PRESI00046; PARTNUM: ERJ-3EKF1004V; UNITCOST: 0.007
R6 = aAcroname:PRESI00002: 3.3K OHM 1/10W +/-5%; ACRONAME: PRESI00002; PARTNUM: ERJ-3GEYJ332V
R7 = aAcroname:PRESI00007: 2.2K OHM 1/10W +/-1%; ACRONAME: PRESI00007; PARTNUM: ERJ-3GEYJ222V
R8 = aAcroname:PRESI00019: 2.4K OHM 1/10W 1%; ACRONAME: PRESI00019; PARTNUM: ERJ-3EKF2431V; UNITCOST: 0.006
R9 = aAcroname:PRESI00056: 6.49K OHM 1/10W +/-1%; ACRONAME: PRESI00056; PARTNUM: ERJ-3EKF6491V; UNITCOST: 0.006
R10 = aAcroname:PRESI00039: 698 OHM 1/10W 1%; ACRONAME: PRESI00039; PARTNUM: ERJ-3EKF6980V
R11 = aAcroname:RESISTOR: General purpose resistor component; ACRONAME: -; RESISTANCE: 4.22k
R12 R18 = aAcroname:PRESI00005: 10.0K OHM 1/10W +/-1%; ACRONAME: PRESI00005; PARTNUM: ERJ-3EKF1002V; UNITCOST: 0.01
R13 = aAcroname:PRESI00041: 0.01 OHM 5.0W 1%; ACRONAME: PRESI00041; PARTNUM: WSR5R0100FEA
R15 = aAcroname:PRESI00018: 200K OHM 1/10W +/-1%
R16 = aAcroname:ERJ-2RKF9101X: 9.1K OHM 1/10W 0402; ACRONAME: -; PARTNUM: ERJ-2RKF9101X; RESISTANCE: 9.1kÛ,1%; UNITCOST: 0.007
R17 = aAcroname:ERJ-2RKF1021X: 1.02K OHM 1/10W 0402; ACRONAME: -; PARTNUM: ERJ-2RKF1021X; RESISTANCE: 1.02kÛ,1%; UNITCOST: 0.007
R23-R30 = aAcroname:PRESI00012: 1.0K OHM 1/6W +/-5% Carbon Film; ACRONAME: PRESI00012; PARTNUM: ?; UNITCOST: 0.1
S1 S3 = aAcroname:PMISC00005: SPDT Slider Switch; ACRONAME: PMISC00005; PARTNUM: 1101M2S3AQE2; UNITCOST: 1.81
S2 = aAcroname:EVQ-PE104K: SWITCH LT TOUCH 6X3.5 100GF SMD; ACRONAME: PMISC00029; PARTNUM: EVQ-PE104K; UNITCOST: 0.5129
U1 = avc:LM3150: Simple Switcher Controller 42V Synchronous Step-Down; ACRONAME: -; PARTNUM: LM3150
U2-U4 = aAcroname:LM1084IS-ADJ: 5A Low Drop Out Adjustable Voltage Regulator; ACRONAME: PCHIP00038; PARTNUM: LM1084IS-ADJ/NOPB
U5 = avc:L3G4200DTR: IC GYROSCOPE MEMS 3AXIS; PARTNUM: L3G4200DTR
U6 = avc:ADXL335: Small low power 3-axis analog output acccelerometer; ALTERNATIVE: ADXL325; PARTNUM: ADXL335
U7 = avc:CMPS10: Devantech CMPS10; PARTNUM: CMPS10
U8 = aAcroname:PCHIP00026: High Side Current Shunt Monitor (2.7V to 60.0V); ACRONAME: PCHIP00026; ALTERNATIVE: INA138NA/250; PARTNUM: INA168NA/250
U9 = aAcroname:ADS7828E: 12-Bit, 8-Channel Sampling Analog-to-Digital Converter with I2C Interface; ACRONAME: PCHIP00039; PARTNUM: ADS7828E/250
U10 = aAcroname:I2C_DIO_EXPANDER: I2C Remote 8-bit I/O Expander 1MHz; ACRONAME: PCHIP00043; PARTNUM: PCA9674PW,118
U11 = aAcroname:MCP1416: High-Speed Power MOSFET Driver 1.5 A High side; ACRONAME: PCHIP00069; PARTNUM: MCP1415T-E/OT
U12 = aAcroname:LTV-356T: Optoisolator 1 channel Output; ACRONAME: PMISC00037; PARTNUM: LTV-356T; UNITCOST: 0.15
U13 = aAcroname:NC7SZ08M5X: AND Gate; ACRONAME: -; PARTNUM: NC7SZ08M5X

## Board
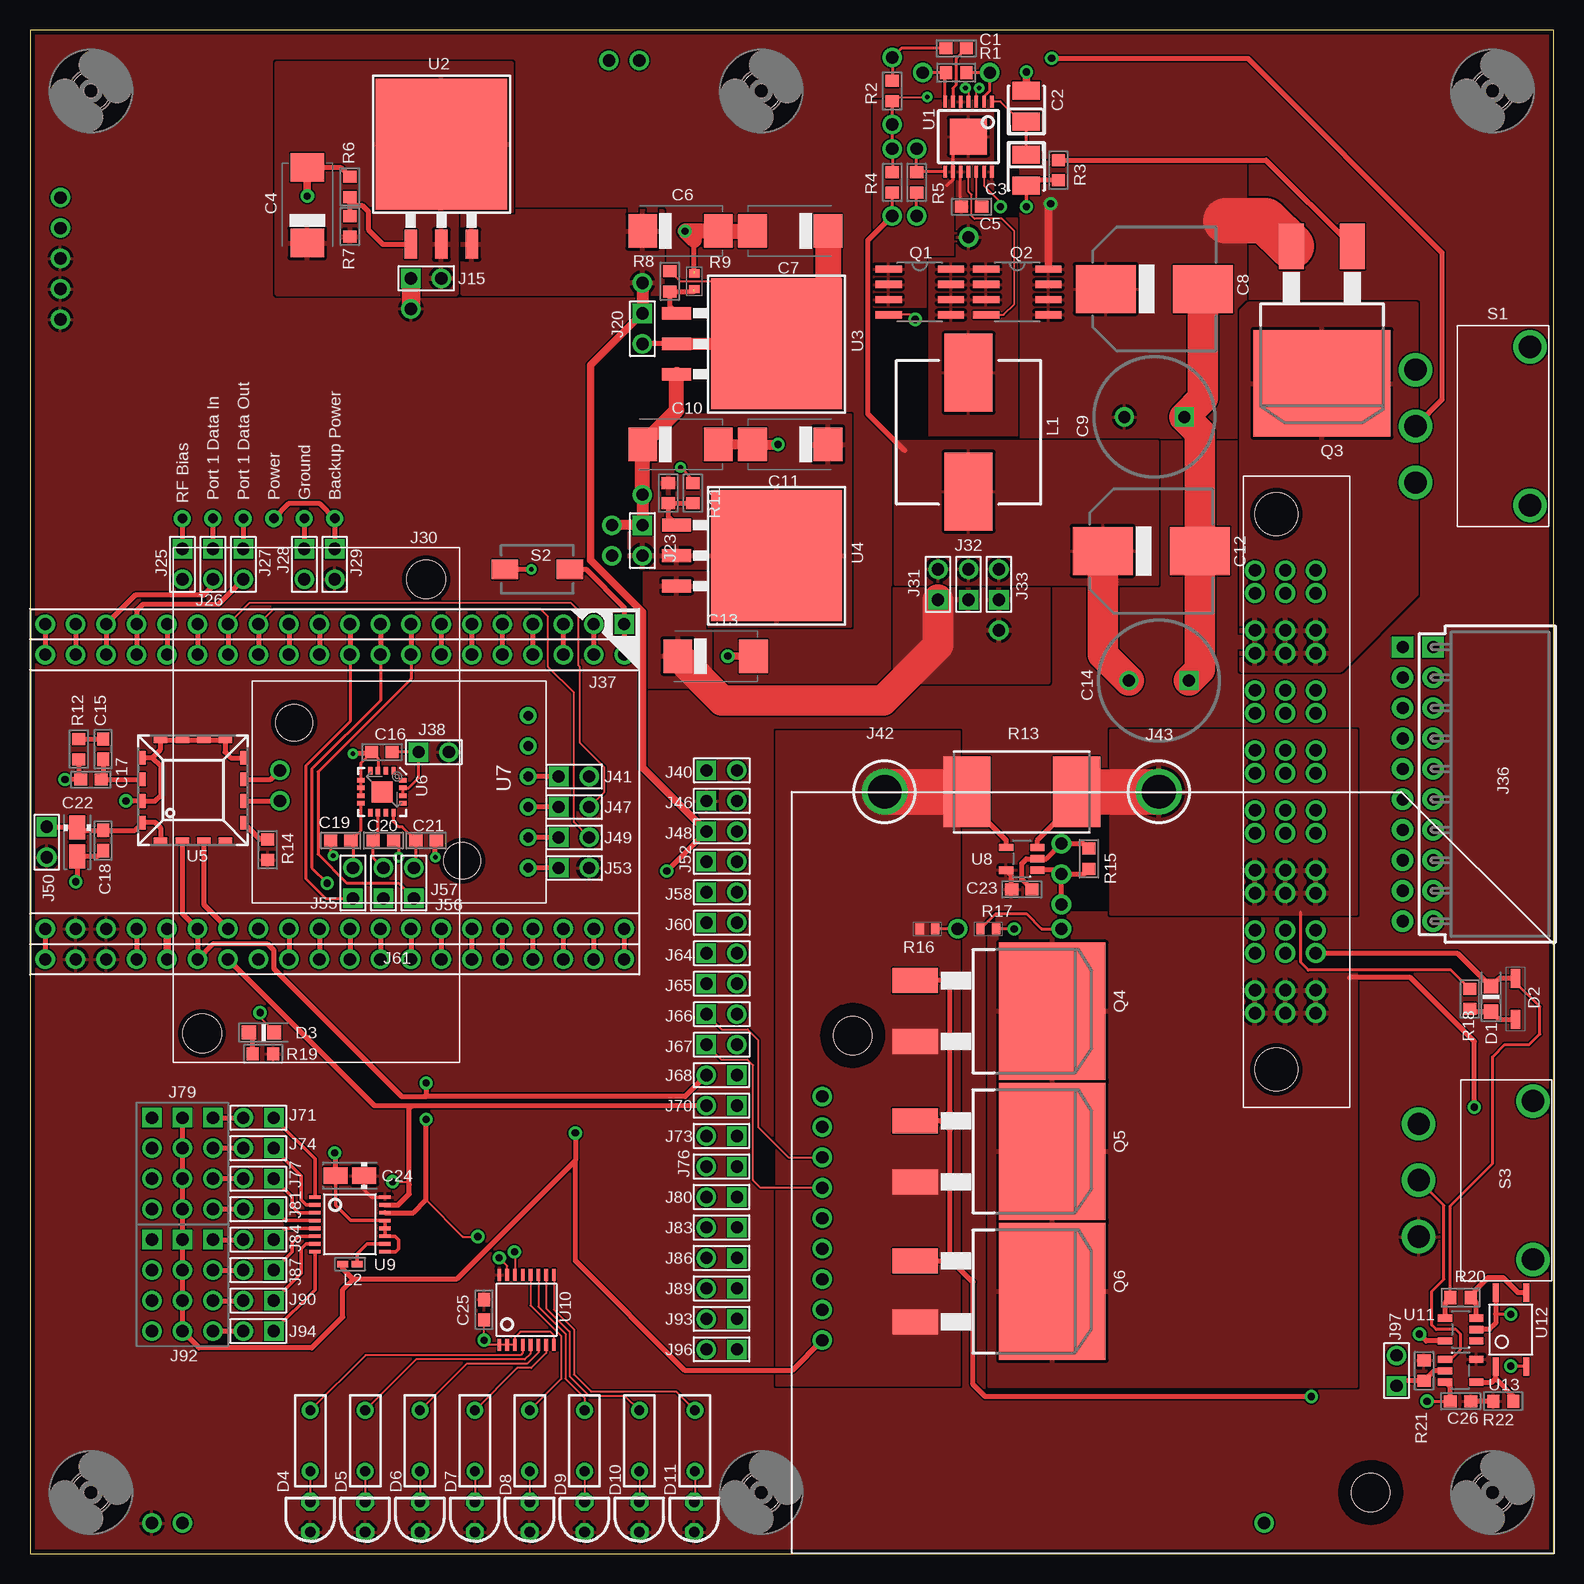
[diagram p7: board, top side]
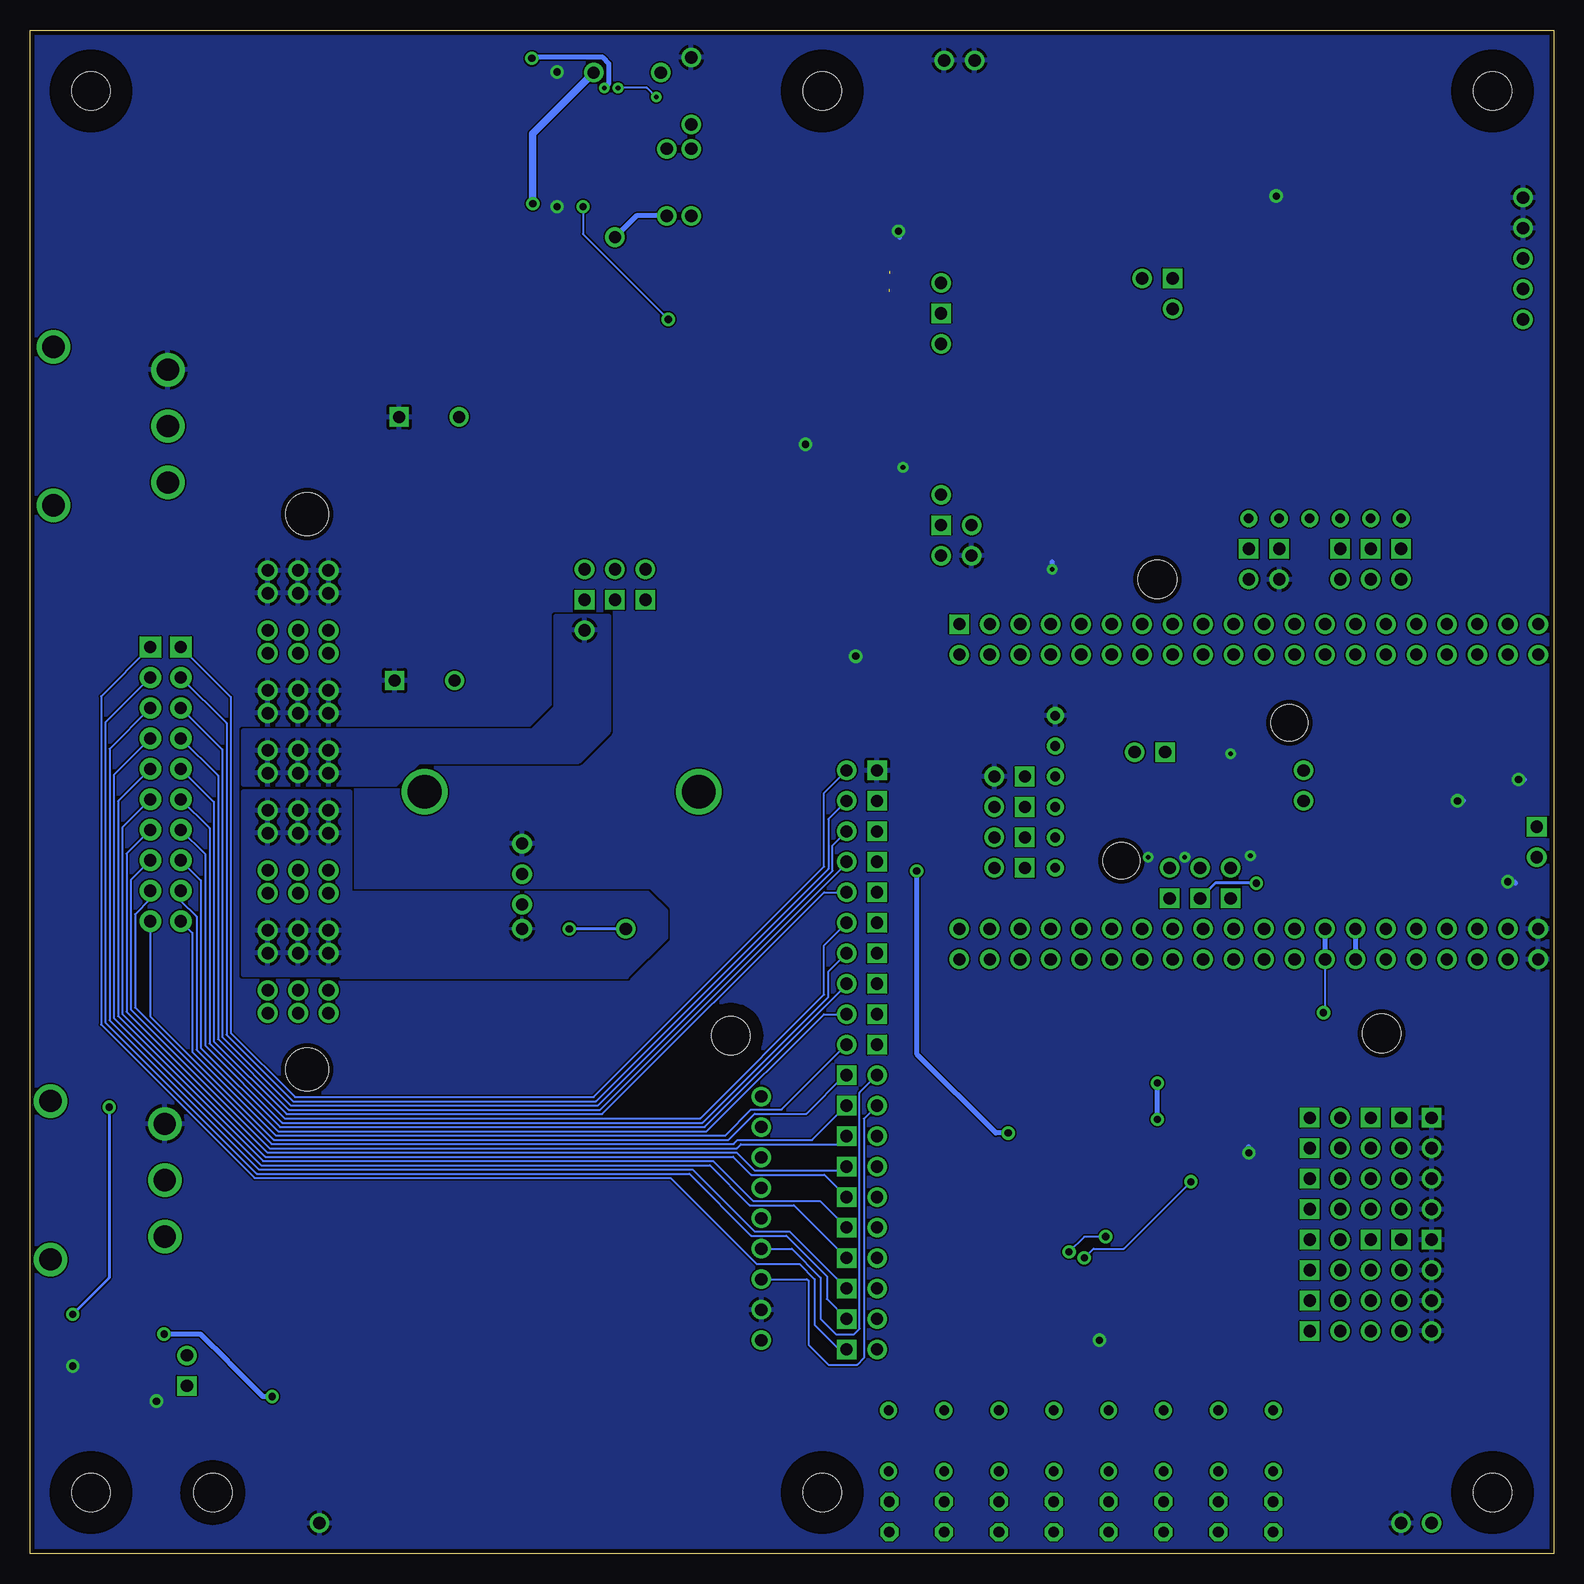
[diagram p8: board, bottom side, seen from below]

Size 127 x 127 mm. Coordinates in mm from the lower left corner, seen from the top.
Outline: 0,0 127,0 127,127 0,127 0,0
Copper layers (1+16): Top 0.0356mm / dielectric 0.2261mm / Bottom 0.0356mm
Design rules: minimum track width 5mil, minimum drill 5mil, track to track 5mil, track to pad 5mil, pad to pad 5mil, via to via 5mil, smd to smd 5mil, copper to edge 15mil, drill to drill 8mil, minimum pad ring 12mil, minimum via ring 10mil, stop-mask expansion 4mil, vias tented up to drill 20mil, thermal gap 10mil

### Footprints (pad centres in the part's own frame; a part is rotated, then mirrored left to right if it is on the bottom)
C0603 = smd 1.1 x 1: 1 -0.85,0; 2 0.85,0
T491 = smd 1.5 x 2.3: + 1.3,0; - -1.3,0
SMC_D = smd 2.4 x 2.8: + -3.15,0; - 3.15,0
PANASONIC_G = smd 4 x 5: + 0,-4.05; - 0,4.05
PANASONIC_NHG_A = drill 1: + 0,2.5 | drill 1 square: - 0,-2.5
SMC_A = smd 2 x 1.35: + 1.2,0; - -1.2,0
CHIPLED_0805 = smd 1.2 x 1.2: A 0,-1.05; C 0,1.05
SOD123 = smd 1.6 x 0.8: A 1.7,0; C -1.7,0
LT3LR1N02-001 = drill 0.889 octagon: A -1.27,0; C 1.27,0
TSW1X1 = drill 1.02: P$1 0,0
TSW1X1_VAL = drill 1.02: P$1 0,0
TSW1X2 = drill 1.02 square: P$1 -1.27,0 | drill 1.02: P$2 1.27,0
GPS15 = drill 0.8: BACKUPPWR 7.62,-5.08; GND 10.16,-5.08; PWR 12.7,-5.08; RFBIAS 20.32,-5.08; SRX 17.78,-5.08; STX 15.24,-5.08 | hole 3.2: 0,0; 18.67,37.85
BRAINSTEMSOCKET = drill 1.02: 3.3V 46.99,29.21; A2D0 19.05,1.27; A2D1 21.59,1.27; A2D2 24.13,1.27; DAC 16.51,1.27; DIO0 1.27,29.21; DIO1 3.81,29.21; DIO2 6.35,29.21; DIO3 8.89,29.21; DIO4 11.43,29.21; DIO5 13.97,29.21; DIO6 16.51,29.21; DIO7 19.05,29.21; DIO8 21.59,29.21; DIO9 24.13,29.21; DIO10/SDA1 26.67,29.21; DIO11/SCL1 29.21,29.21; GND 49.53,29.21; PE_0 3.81,1.27; PE_1 6.35,1.27; PE_2 8.89,1.27; PE_3 11.43,1.27; PE_4 13.97,1.27; RTCV 44.45,29.21; SCL 36.83,29.21; SDA 34.29,29.21; T0 46.99,1.27; T1 49.53,1.27; UART0_RX 41.91,1.27; UART0_RX_LED 36.83,1.27; UART0_TX 44.45,1.27; UART0_TX_LED 39.37,1.27; UART1_RX 31.75,1.27; UART1_RX_LED 26.67,1.27; UART1_TX 34.29,1.27; UART1_TX_LED 29.21,1.27; VTRANSPORT 41.91,29.21; VUNREGULATED 39.37,29.21; WATCHDOG 31.75,29.21 | drill 1.02 square: !RESET 1.27,1.27
IPL1-110-01-S-RA = drill 1.016 pad 1.778 square: 1 0,0; 11 0,-2.54 | drill 1.016 pad 1.778: 2 2.54,0; 3 5.08,0; 4 7.62,0; 5 10.16,0; 6 12.7,0; 7 15.24,0; 8 17.78,0; 9 20.32,0; 10 22.86,0; 12 2.54,-2.54; 13 5.08,-2.54; 14 7.62,-2.54; 15 10.16,-2.54; 16 12.7,-2.54; 17 15.24,-2.54; 18 17.78,-2.54; 19 20.32,-2.54; 20 22.86,-2.54
TSW1X20 = drill 1.02: P$1 -22.86,0; P$2 -20.32,0; P$3 -17.78,0; P$4 -15.24,0; P$5 -12.7,0; P$6 -10.16,0; P$7 -7.62,0; P$8 -5.08,0; P$9 -2.54,0; P$10 0,0; P$11 2.54,0; P$12 5.08,0; P$13 7.62,0; P$14 10.16,0; P$15 12.7,0; P$16 15.24,0; P$17 17.78,0; P$18 20.32,0; P$19 22.86,0; P$20 25.4,0
TSW1X1_12AWG = drill 2.8: P$1 0,0
MPT-08-XX-X-RA-XX = drill 1.04: 1@0 -18.44,-3.3; 1@1 -18.44,-0.76; 1@2 -18.44,1.78; 1@3 -16.56,-3.3; 1@4 -16.56,-0.76; 1@5 -16.56,1.78; 2@0 -13.44,-3.3; 2@1 -13.44,-0.76; 2@2 -13.44,1.78; 2@3 -11.56,-3.3; 2@4 -11.56,-0.76; 2@5 -11.56,1.78; 3@0 -8.44,-3.3; 3@1 -8.44,-0.76; 3@2 -8.44,1.78; 3@3 -6.56,-3.3; 3@4 -6.56,-0.76; 3@5 -6.56,1.78; 4@0 -3.44,-3.3; 4@1 -3.44,-0.76; 4@2 -3.44,1.78; 4@3 -1.56,-3.3; 4@4 -1.56,-0.76; 4@5 -1.56,1.78; 5@0 1.56,-3.3; 5@1 1.56,-0.76; 5@2 1.56,1.78; 5@3 3.44,-3.3; 5@4 3.44,-0.76; 5@5 3.44,1.78; 6@0 6.56,-3.3; 6@1 6.56,-0.76; 6@2 6.56,1.78; 6@3 8.44,-3.3; 6@4 8.44,-0.76; 6@5 8.44,1.78; 7@0 11.56,-3.3; 7@1 11.56,-0.76; 7@2 11.56,1.78; 7@3 13.44,-3.3; 7@4 13.44,-0.76; 7@5 13.44,1.78; 8@0 16.56,-3.3; 8@1 16.56,-0.76; 8@2 16.56,1.78; 8@3 18.44,-3.3; 8@4 18.44,-0.76; 8@5 18.44,1.78 | hole 3.56: -23.14,0; 23.14,0
TSW3X4RA = drill 1.02 square: P$1 -6.35,-2.54; P$8 -6.35,0; P$9 -6.35,2.54 | drill 1.02: P$2 -3.81,-2.54; P$3 -1.27,-2.54; P$4 1.27,-2.54; P$5 1.27,0; P$6 -1.27,0; P$7 -3.81,0; P$10 -3.81,2.54; P$11 -1.27,2.54; P$12 1.27,2.54
7447709004 = smd 6.5 x 4: 1 -4.95,0; 2 4.95,0
L0402 = smd 0.889 x 0.559: 1 -0.603,0; 2 0.603,0
3,2 = hole 3.2: 0,0
BRAINSTEM_MOUNT = hole 3.2: 48.26,5.08; 5.08,43.18
SO-08 = smd 0.6 x 2.2: 1 -1.905,-2.6; 2 -0.635,-2.6; 3 0.635,-2.6; 4 1.905,-2.6; 5 1.905,2.6; 6 0.635,2.6; 7 -0.635,2.6; 8 -1.905,2.6
D2PACK = smd 11.43 x 8.89: D 0,2.54 | smd 2.083 x 3.81: G -2.54,-8.89; S 2.54,-8.89
R0603 = smd 1 x 1.1: 1 -0.85,0; 2 0.85,0
R0402 = smd 0.7 x 0.9: 1 -0.65,0; 2 0.65,0
R4527 = smd 3.94 x 5.84: 1 -4.575,0; 2 4.575,0
R0402@1 = smd 0.7 x 0.9: 1 -0.65,0; 2 0.65,0
CFR-12 = drill 0.8: P$1 -2.54,0; P$2 2.54,0
SPDTRA = drill 1.854: 1 4.699,4.763; 2 0,4.763; 3 -4.699,4.763; 4 6.604,-4.763; 5 -6.604,-4.763
SPST-NO = smd 2.2 x 1.6: P$1 -2.7,0; P$2 2.7,0
TSSOP14EXP = smd 0.305 x 0.991: 1 -1.95,-2.918; 2 -1.3,-2.918; 3 -0.65,-2.918; 4 0,-2.918; 5 0.65,-2.918; 6 1.3,-2.918; 7 1.95,-2.918; 8 1.95,2.918; 9 1.3,2.918; 10 0.65,2.918; 11 0,2.918; 12 -0.65,2.918; 13 -1.3,2.918; 14 -1.95,2.918 | smd 3.1 x 3: PAD 0,0
TO263-3 = smd 1.067 x 2.413: 1 -2.54,-5.791; 2 0,-5.791; 3 2.54,-5.791 | smd 10.922 x 10.922: TAB 0,2.54
LGA16 = smd 0.5 x 1.127: 1 -4.186,2.696; 2 -4.187,0.898; 3 -4.187,-0.898; 4 -4.187,-2.696; 9 4.186,-2.696; 10 4.187,-0.898; 11 4.187,0.898; 12 4.187,2.696 | smd 1.127 x 0.5: 5 -2.696,-4.186; 6 -0.898,-4.187; 7 0.898,-4.187; 8 2.696,-4.187; 13 2.696,4.186; 14 0.898,4.187; 15 -0.898,4.187; 16 -2.696,4.187
LFCSP-16 = smd 1.75 x 1.75: 0 0,0 | smd 0.65 x 0.37: 1 -1.75,0.975; 2 -1.75,0.325; 3 -1.75,-0.325; 4 -1.75,-0.975; 9 1.75,-0.975; 10 1.75,-0.325; 11 1.75,0.325; 12 1.75,0.975 | smd 0.37 x 0.65: 5 -0.975,-1.75; 6 -0.325,-1.75; 7 0.325,-1.75; 8 0.975,-1.75; 13 0.975,1.75; 14 0.325,1.75; 15 -0.325,1.75; 16 -0.975,1.75
CMPS10 = drill 0.8: 3.3V 0,6.35; FACTORY 0,-3.81; GND 0,-6.35; MODE 0,-1.27; RX 0,1.27; TX 0,3.81 | hole 3.05: 5.5,5.75; 19.5,-5.75
SOT23-5 = smd 0.6 x 1.2: 1 -0.95,-1.306; 2 0,-1.306; 3 0.95,-1.306; 4 0.95,1.306; 5 -0.95,1.306
TSSOP16 = smd 0.305 x 0.991: 1 -2.275,-2.918; 2 -1.625,-2.918; 3 -0.975,-2.918; 4 -0.325,-2.918; 5 0.325,-2.918; 6 0.975,-2.918; 7 1.625,-2.918; 8 2.275,-2.918; 9 2.275,2.918; 10 1.625,2.918; 11 0.975,2.918; 12 0.325,2.918; 13 -0.325,2.918; 14 -0.975,2.918; 15 -1.625,2.918; 16 -2.275,2.918
4-SMD = smd 0.508 x 1.524: 1 -1.27,-3.075; 2 1.27,-3.075; 3 1.27,3.075; 4 -1.27,3.075

### Placement (x,y rotation side)
C1  77.22,125.48 180 top
C2  83.06,120.65 270 top
C3  83.06,115.32 90 top
C4  23.11,112.39 90 top
C5  78.49,112.27 0 top
C6  54.23,110.24 0 top
C7  63.37,110.24 180 top
C8  93.73,105.41 270 top
C9  93.73,94.74 90 top
C10  54.23,92.46 0 top
C11  63.37,92.46 180 top
C12  93.47,83.57 270 top
C13  57.15,74.8 0 top
C14  94.11,72.77 90 top
C15  6.1,67.06 270 top
C16  29.34,66.8 180 top
C17  5.08,64.52 180 top
C18  6.1,59.44 270 top
C19  25.91,59.44 180 top
C20  29.46,59.44 0 top
C21  33.02,59.44 0 top
C22  3.94,59.31 90 top
C23  82.68,55.37 180 top
C24  26.67,31.5 0 top
C25  37.85,20.32 270 top
C26  119.25,12.7 0 top
D1  121.79,46.23 0 top
D2  123.83,46.23 270 top
D3  19.3,43.43 270 top
D4  23.37,3.05 90 top
D5  27.94,3.05 90 top
D6  32.51,3.05 90 top
D7  37.08,3.05 90 top
D8  41.66,3.05 90 top
D9  46.23,3.05 90 top
D10  50.8,3.05 90 top
D11  55.37,3.05 90 top
J1  71.88,124.71 0 top
J2  48.26,124.46 270 top
J3  50.8,124.46 270 top
J4  74.42,123.44 0 top
J5  80.01,123.44 0 top
J6  71.88,119.13 0 top
J7  71.88,117.09 0 top
J8  73.91,117.09 180 top
J9  2.54,113.03 0 top
J10  71.88,111.51 0 top
J11  73.91,111.51 90 top
J12  2.54,110.49 0 top
J13  78.23,109.73 90 top
J14  2.54,107.95 0 top
J15  33.02,106.3 0 top
J16  51.05,105.92 180 top
J17  2.54,105.41 0 top
J18  31.75,103.76 0 top
J19  2.54,102.87 0 top
J20  51.05,102.11 270 top
J21  51.05,88.27 180 top
J22  48.51,85.72 270 top
J23  51.05,84.45 270 top
J24  48.51,83.19 270 top
J25  12.7,82.47 270 top
J26  15.24,82.47 270 top
J27  17.78,82.47 270 top
J28  22.86,82.47 270 top
J29  25.4,82.47 270 top
J30  33.02,81.2 180 top
J31  75.69,80.77 90 top
J32  78.23,80.77 90 top
J33  80.77,80.77 90 top
J34  50.8,78.74 180 top
J35  80.77,76.96 180 top
J36  116.97,75.56 270 top
J37  26.67,74.93 180 top
J38  33.66,66.8 0 top
J39  20.83,65.28 0 top
J40  57.66,65.28 0 top
J41  45.34,64.77 0 top
J42  71.25,63.5 0 top
J43  94.11,63.5 0 top
J44  103.89,63.5 90 top
J45  20.83,62.74 0 top
J46  57.66,62.74 0 top
J47  45.34,62.23 0 top
J48  57.66,60.2 0 top
J49  45.34,59.69 0 top
J50  1.4,59.31 270 top
J51  85.98,59.18 0 top
J52  57.66,57.66 0 top
J53  45.34,57.15 0 top
J54  85.98,56.64 270 top
J55  26.92,55.88 90 top
J56  29.46,55.88 90 top
J57  32,55.88 90 top
J58  57.66,55.12 0 top
J59  85.98,54.1 0 top
J60  57.66,52.58 0 top
J61  26.67,52.07 180 top
J62  77.34,52.07 90 top
J63  85.98,52.07 0 top
J64  57.66,50.04 0 top
J65  57.66,47.5 0 top
J66  57.66,44.96 0 top
J67  57.66,42.42 0 top
J68  57.66,39.88 180 top
J69  66.04,38.1 0 top
J70  57.66,37.34 180 top
J71  19.05,36.32 180 top
J72  66.04,35.56 0 top
J73  57.66,34.8 180 top
J74  19.05,33.78 180 top
J75  66.04,33.02 0 top
J76  57.66,32.26 180 top
J77  19.05,31.24 180 top
J78  66.04,30.48 0 top
J79  12.7,29.97 270 top
J80  57.66,29.72 180 top
J81  19.05,28.7 180 top
J82  66.04,27.94 0 top
J83  57.66,27.18 180 top
J84  19.05,26.16 180 top
J85  66.04,25.4 0 top
J86  57.66,24.64 180 top
J87  19.05,23.62 180 top
J88  66.04,22.86 0 top
J89  57.66,22.1 180 top
J90  19.05,21.08 180 top
J91  66.04,20.32 0 top
J92  12.7,19.81 270 top
J93  57.66,19.56 180 top
J94  19.05,18.54 180 top
J95  66.04,17.78 0 top
J96  57.66,17.02 180 top
J97  113.92,15.24 90 top
J98  10.16,2.54 90 top
J99  12.7,2.54 90 top
J100  102.87,2.54 90 top
L1  78.23,93.47 270 top
L2  26.67,24.13 180 top
M1  5.08,121.92 0 top
M2  60.96,121.92 0 top
M3  121.92,121.92 0 top
M4  5.08,5.08 0 top
M5  60.96,5.08 0 top
M6  121.92,5.08 0 top
M7  63.5,0 0 top
Q1  74.17,105.16 270 top
Q2  82.3,105.16 270 top
Q3  107.7,100.08 180 top
Q4  82.68,45.21 270 top
Q5  82.68,33.53 270 top
Q6  82.68,21.84 270 top
R1  77.22,123.44 180 top
R2  71.88,121.92 90 top
R3  85.72,115.32 270 top
R4  71.88,114.3 90 top
R5  73.91,114.3 270 top
R6  26.67,113.92 270 top
R7  26.67,110.62 270 top
R8  53.34,106.05 90 top
R9  55.37,106.05 270 top
R10  53.21,88.39 90 top
R11  55.24,88.39 270 top
R12  4.06,67.06 270 top
R13  82.68,63.5 0 top
R14  19.81,58.67 270 top
R15  88.27,57.91 270 top
R16  74.8,52.07 180 top
R17  79.88,52.07 0 top
R18  120.02,46.23 90 top
R19  19.43,41.66 0 top
R20  119.25,21.34 0 top
R21  116.2,15.24 90 top
R22  122.81,12.7 180 top
R23  23.37,9.4 270 top
R24  27.94,9.4 270 top
R25  32.51,9.4 270 top
R26  37.08,9.4 270 top
R27  41.66,9.4 270 top
R28  46.23,9.4 270 top
R29  50.8,9.4 270 top
R30  55.42,9.4 270 top
S1  120.27,93.98 90 top
S2  42.29,82.04 0 top
S3  120.52,31.11 90 top
U1  78.23,118.11 180 top
U2  34.29,114.94 0 top
U3  59.69,100.84 270 top
U4  59.69,83.19 270 top
U5  13.59,63.63 90 top
U6  29.34,63.5 270 top
U7  41.53,63.5 180 top
U8  82.68,57.91 90 top
U9  26.67,27.43 270 top
U10  41.4,20.32 0 top
U11  119.25,18.67 90 top
U12  123.44,18.67 0 top
U13  119.25,15.24 270 top

### Tracks (layer width: path | path; a pad name or v marks a point on that pad's centre or on a via)
3V3
  Top 0.305: U9.16 28.46,29.71 27.87,30.3 C24.+
  Top 0.406: U8.5 81.83,56.51 C23.2 | R22.2 C26.2
  Top 1.524: J18.P$1 J15.P$1
  pour Top (rank 6): 0,0 0,127 127,127 127,0
5V0  (via drill 0.6)
  Top 0.406: J48.P$1 v53.09,56.9 | 26.92,22.86 35.56,22.86 45.47,32.77 | 26.92,22.86 26.07,23.72 L2.2 | J79.P$8 J79.P$7 J79.P$6 J79.P$5 J92.P$8 J92.P$7 J92.P$6 J92.P$5 14.1,17.14 23.5,17.14 26.07,19.72 26.07,22 26.92,22.86 | v45.47,35.05 45.47,32.77 | J95.P$1 63.5,15.24 54.61,15.24 45.47,24.38 45.47,32.77
  Top 0.61: J20.P$1 46.74,99.06 46.74,82.8 51.05,78.49 51.05,65.53 J48.P$1
  Top 1.016: J16.P$1 J20.P$1
  Bottom 0.406: v53.09,56.9 53.09,41.66 46.48,35.05 v45.47,35.05
  pour Top (rank 2): 36.07,105.03 36.07,111.89 52.7,111.89 52.7,105.03
9.0V
  Top 0.813: J23.P$1 J22.P$1
  Top 1.016: J21.P$1 J23.P$1
  Top 1.27: J21.P$1 51.05,91.82 50.8,92.08 50.8,92.18 C10.+ 53.9,95.28 U3.3
12.0V
  Top 2.54: J31.P$1 75.69,75.69 71.12,71.12 57.68,71.12 C13.+
  pour Top (rank 2): 56.64,81.92 56.64,72.26 51.31,72.26 51.31,81.92
  pour Top (rank 2): 72.14,80.52 84.84,80.52 84.84,72.64 72.14,72.64
  pour Bottom (rank 2): 109.22,64.14 96.52,64.14 94.61,66.04 81.28,66.04 78.74,68.58 78.74,78.11 83.19,78.11 83.19,70.48 85.09,68.58 109.22,68.58
!RESET
  Top 0.406: J37.P$1 J34.!RESET 49.53,78.87 46.35,82.04 S2.P$2
A2D0
  Top 0.254: J37.P$8 31.75,72.9 24,65.15 24,58.29 26.42,55.88 30.73,55.88 J57.P$1
  Top 0.406: J34.A2D0 J37.P$8
A2D1  (via drill 0.6)
  Top 0.254: J37.P$9 29.21,71.12 23.5,65.41 23.5,57.15 v24.77,55.88
  Top 0.406: J34.A2D1 J37.P$9
  Bottom 0.254: v24.77,55.88 28.19,55.88 J56.P$1
A2D2
  Top 0.254: J37.P$10 26.67,69.34 22.99,65.66 22.99,56.26 24.64,54.61 J55.P$1
  Top 0.406: J34.A2D2 J37.P$10
BATTERY_MOTOR+_IN  (via drill 0.6)
  Top 0.254: v123.44,19.94 122.17,19.94
  Top 0.406: U12.4 122.17,19.94 122.17,19.18 121.67,18.67 U11.2 | v120.4,37.21 120.4,42.67 115.06,48.01 109.98,48.01
  Bottom 0.254: v120.4,37.21 120.4,22.99 v123.44,19.94
  pour Top (rank 2): 80.01,53.34 110.49,53.34 110.49,13.97 80.01,13.97
BATTERY_MOTOR+_OUT
  Top 0.254: R18.2 118.45,48.64 106.55,48.64 105.92,49.28 105.92,53.47
  Top 0.406: U8.3 83.98,59.47 87.25,62.74 R13.2
  Top 3.81: R13.2 J43.P$1
  pour Top: 90.17,68.58 110.49,68.58 110.49,53.34 90.17,53.34
BATTERY_MOTOR+_OUT_PRE
  Top 0.406: U8.4 81.37,59.47 78.1,62.74 R13.1
  Top 3.81: J42.P$1 R13.1
  pour Top (no thermals): 77.47,68.58 77.47,13.97 62.23,13.97 62.23,68.58
DIO0
  Top 0.406: J61.P$1 J34.DIO0
DIO1
  Top 0.406: J61.P$2 J34.DIO1
DIO2
  Top 0.406: J61.P$3 J34.DIO2
DIO3
  Top 0.406: J61.P$4 J34.DIO3
DIO4
  Top 0.406: J61.P$5 J34.DIO4
DIO5
  Top 0.406: J61.P$6 J34.DIO5
DIO6
  Top 0.406: J61.P$7 J34.DIO6
DIO7
  Top 0.406: J61.P$8 J34.DIO7
DIO8
  Top 0.406: J61.P$9 J34.DIO8
DIO9
  Top 0.406: J61.P$10 J34.DIO9
DIO10
  Top 0.406: J61.P$11 J34.DIO10/SDA1
DIO11
  Top 0.406: J61.P$12 J34.DIO11/SCL1
GND  (via drill 0.38, 0.6)  (1 unrouted)
  Top 0.178: U10.8 43.68,18.2 43.38,18.49 40.89,18.49 40.43,18.02 U10.3 U10.2 U10.1 38.22,17.4 v37.85,17.78 C25.2
  Top 0.254: R2.2 J1.P$1 72.64,125.48 C1.2 | U6.7 U6.6 U6.5 27.59,65.9 C16.2 29.01,66.28 U6.3 | v116.46,12.7 C26.1 | U12.2 124.69,15.62 v123.44,15.62 | R11.1 55.24,89.53 v54.23,90.55 | 30.73,59.02 v30.73,58.04 | C19.2 25.06,58.38 v25.27,58.17
  Top 0.305: U9.9 30.49,25.16 30.73,25.4 30.73,26.16 30.44,26.46 U9.11 U9.12 U9.13 26.73,27.76 25.47,29.01 C24.- | C3.- 83.06,113.92 v83.06,112.27 | C20.2 30.73,59.02
  Top 0.406: J61.P$20 J34.GND | R6.1 25.89,115.55 C4.- | R15.1 87.84,59.18 J51.P$1 84.71,57.91 U8.2 83.06,57.91 82.68,57.53 82.68,56.22 C23.1 | R12.2 4.06,64.52 C17.2 v2.92,64.52 | C18.2 5.62,58.11 C22.- 3.94,56.13 v3.81,56.01 | U5.8 16.73,66.32 16.26,66.8 16.26,67.78 U5.9 U5.10 | U5.10 | U5.10 U5.11 U5.12 10.89,67.03 10.19,66.32 | 10.19,66.32 U5.13 | 10.19,66.32 10.92,65.59 10.92,63.25 10.4,62.73 U5.15 8.01,62.73 v8,62.74 | C21.2 33.78,59.44 v33.78,58.04 | v26.92,66.67 28.49,66.67 C16.2 | C26.1 118.4,13.83 U13.3 | C24.- 25.47,33.33 v25.4,33.4 | 55.37,106.89 55.37,109.47 | S2.P$1 v41.78,82.04 | R3.2 83.61,114.47 83.06,113.92
  Top 0.61: v58.17,74.8 C13.- | v23.11,113.16 C4.- | C2.- v83.06,123.5
  Top 0.813: C10.- C11.- v62.36,92.46
  Top 1.27: C7.- C6.- v54.61,110.24 55.37,109.47
  Top 2.54: C14.- 97.52,73.69 C12.- 97.52,93.45 C9.- 97.78,96.29 C8.-
  Bottom 0.406: v3.81,56.01 3.3,56.01 3.17,55.88 | v8,62.74 7.49,62.74 | v2.92,64.52 2.41,64.52 | v25.4,33.4 25.4,33.91 | v54.61,110.24 54.61,109.86 54.48,109.73 | v41.78,82.04 41.78,82.68
  pour Bottom (rank 6): 0,0 0,127 127,127 127,0
GND3
  Top 0.254: 123.76,47.82 123.83,47.75 123.83,47.62 125.86,45.59 125.86,43.31 124.97,42.42 122.94,42.42 121.92,41.4 121.92,32.51 118.4,29 R20.1 | 123.76,47.82 123.7,47.88 | D1.C 121.79,47.24 | D2.C 123.83,47.88 123.76,47.82 | R17.1 80.5,53.34 83.06,53.34 84.33,52.07 J63.P$1
  Top 0.406: D2.C 122.44,47.93 D1.C | R20.1 117.95,20.88 U11.4 | J44.2@0 118.98,50.06 121.79,47.24
  pour Bottom: 100.33,63.5 109.22,63.5 109.22,48.26 100.33,48.26
  pour Bottom: 101.09,48.01 77.22,48.01 73.91,51.31 73.91,53.59 75.44,55.12 101.09,55.12
GP2_D1
  Top 0.178: J78.P$1 60.91,30.48 60.27,31.11 60.27,40.69 59.82,41.15 57.66,41.15 J67.P$1
GP2_D2
  Top 0.178: J66.P$1 57.66,43.69 59.82,43.69 60.71,42.8 60.71,35.56 63.25,33.02 J75.P$1
I2C_CH0
  Top 0.406: J79.P$9 J71.P$2
I2C_CH1
  Top 0.406: J74.P$2 J79.P$10
I2C_CH2
  Top 0.406: J77.P$2 J79.P$11
I2C_CH3
  Top 0.406: J81.P$2 J79.P$12
I2C_CH4
  Top 0.406: J92.P$9 J84.P$2
I2C_CH5
  Top 0.406: J92.P$10 J87.P$2
I2C_CH6
  Top 0.406: J92.P$11 J90.P$2
I2C_CH7
  Top 0.406: J92.P$12 J94.P$2
IMOTOR_A2D
  Top 0.406: J54.P$1 85.66,56.96 U8.1 | R15.2 87.84,56.64 J54.P$1 | J59.P$1 J54.P$1
N$1
  Top 0.406: U4.1 53.21,86.41 R10.1 R11.2
N$2  (via drill 0.38, 0.6)
  Top 0.178: U1.3 78.88,121.94
  Top 0.254: 78.88,121.94 v79.12,122.17 79.25,122.17
  Top 0.406: v85.17,124.64 101.52,124.64 117.7,108.46 117.7,96.18 S1.2
  Bottom 0.178: v79.12,122.17 79.25,122.17
  Bottom 0.406: v79.12,122.17 78.74,122.56 78.74,124.21 79.25,124.71 85.09,124.71 v85.17,124.64
N$3  (via drill 0.6)
  Top 0.406: Q4.G 76.45,47.75 76.71,47.5 76.71,36.83 75.95,36.07 | 75.95,36.07 Q5.G | Q6.G 76.2,24.38 76.52,24.7 | 76.52,24.7 76.71,24.89 76.71,35.31 75.95,36.07 | v106.81,13.08 79.63,13.08 78.61,14.1 78.61,22.61 76.52,24.7 | 116.08,18.03 v115.82,18.29 116.39,17.72 U11.5
  Bottom 0.406: v115.82,18.29 112.78,18.29 110.49,16 110.36,15.88 107.57,13.08 v106.81,13.08
N$4
  Top 0.406: D2.A 122.44,44.53 D1.A 120.22,45.18 R18.1
N$5
  Top 0.406: U13.4 121.86,14.29 122.17,14.61 | 122.17,14.61 U12.1 | R22.1 123.66,13.12 122.17,14.61
N$6  (1 unrouted)
  Top 0.406: U3.1 53.34,103.94 R8.1 55.37,105.19
N$7
  Top 0.406: R7.1 26.67,112.39 | 26.67,112.39 R6.2 | 26.67,112.39 27.69,112.39 28.19,111.89 28.19,110.36 29.41,109.14 U2.1
N$8
  Top 0.254: U13.1 118.42,16.19 119.25,17.02 119.25,18.29 118.87,18.67 117.22,18.67 116.84,19.05 116.84,21.84 117.86,22.86 117.86,29.02 S3.2
N$9
  Top 0.406: D3.A 18.58,43.11 R19.1
N$12  (via drill 0.6)
  Top 0.178: v19.18,45.09 19.18,44.7 20.45,43.43 | 20.45,43.43 20.7,43.43 | 20.45,43.43 D3.C
  Bottom 0.178: J34.WATCHDOG 19.05,45.21 v19.18,45.09
  Bottom 0.406: J61.P$13 J34.WATCHDOG
N$13
  Top 0.178: R23.P$2 D4.C
N$16
  Top 0.406: J34.PE_0 J37.P$2
N$17
  Top 0.406: J34.PE_1 J37.P$3
N$18
  Top 0.406: J34.PE_2 J37.P$4
N$19
  Top 0.406: J34.PE_3 J37.P$5
N$20
  Top 0.406: J34.PE_4 J37.P$6
N$21
  Top 0.406: J34.DAC J37.P$7
N$22
  Top 0.406: J34.UART1_RX_LED J37.P$11
N$23
  Top 0.406: J34.UART1_TX_LED J37.P$12
N$24
  Top 0.406: J41.P$1 U7.MODE
N$25
  Top 0.305: U9.1 23.75,32.89 J71.P$1
N$26
  Top 0.406: J34.UART0_RX_LED J37.P$15
N$27
  Top 0.406: J34.UART0_TX_LED J37.P$16
N$28
  Top 0.406: J50.P$1 1.47,60.51 C22.+ 4.16,60.29 C18.1 8.76,60.29 U5.16 9.43,60.96 10.41,60.96 10.89,60.48 U5.1
N$29
  Top 0.406: R14.1 19.18,59.52 U5.5
N$30
  Top 0.406: J34.T0 J37.P$19
N$31
  Top 0.406: J34.T1 J37.P$20
N$32
  Top 0.406: J29.P$1 J30.BACKUPPWR 24.18,87.5 21.54,87.5 J30.PWR
N$33
  Top 0.406: J30.GND J28.P$1
N$34
  Top 0.406: J30.STX J27.P$1
N$35
  Top 0.406: J30.SRX J26.P$1
N$36
  Top 0.406: J30.RFBIAS J25.P$1
N$37
  Top 0.406: U5.14 C17.1 6.1,64.52 C15.2
N$38
  Top 0.406: R12.1 C15.1
N$39
  Top 0.406: U5.7 20.08,64.53 J39.P$1
N$40
  Top 0.406: U5.6 20.82,62.73 J45.P$1
N$41
  Top 0.305: U9.10 28.09,25.81 27.27,24.99 L2.1
N$42
  Top 0.254: J10.P$1 R4.1
  Top 0.406: J10.P$1 69.85,109.47 69.85,95 72.9,91.95
  Top 2.54: C12.+ 89.42,74.96 C14.+
  pour Top: 72.14,92.71 93.98,92.71 93.98,80.77 72.14,80.77
N$43
  Top 0.406: J53.P$1 U7.3.3V
N$44
  Top 0.406: J61.P$17 J34.VTRANSPORT
N$45
  Top 0.178: U1.1 80.9,121.03 82.3,119.63
  Top 0.254: C3.+ C2.+ 82.77,119.63 82.3,119.63
N$46
  Bottom 0.178: J36.1 121.08,71.45 121.08,44.09 108.28,31.29 73.58,31.29 66.42,24.13 62.87,24.13 61.59,22.86 61.59,19.05 59.56,17.02 J96.P$1
N$47
  Top 0.305: U1.PAD 76.93,116.81 U1.9 76.93,114.52 76.45,114.05
  pour Top (rank 4): 70.36,103.89 70.36,121.16 80.26,121.16 80.26,103.89
N$48  (via drill 0.6)
  Top 0.178: U1.13 79.53,114.02 80.9,112.65 v80.9,112.27 | v73.79,102.87 73.41,103.25 Q1.4
  Bottom 0.178: v80.9,112.27 80.9,109.98 v73.79,102.87
N$49
  Top 0.178: U1.11 78.23,113.54 78.49,113.28 78.49,111.51 78.74,111.25 81.03,111.25 82.04,110.24 82.04,104.14 81.15,103.25 Q2.4
N$50
  Top 0.406: R3.1 103.04,116.17 Q3.G
N$51
  Top 0.254: J4.P$1 R1.2 76.28,123.36 U1.7
N$52
  Top 0.254: U1.10 77.58,112.32 C5.1 | J11.P$1 R5.2
  Bottom 0.406: J11.P$1 76.45,111.51 J13.P$1
  pour Top (rank 2): 74.93,93.22 82.3,93.22 82.3,111.25 78.23,111.25 78.23,115.82 77.22,115.82 77.22,107.95 74.93,107.95
N$53
  Top 0.178: U1.12 78.88,112.72 C5.2
N$54  (via drill 0.38)
  Top 0.178: R2.1 72.22,121.41 v74.8,121.41 | v77.98,122.17 78.23,121.92 U1.4
  Top 0.254: R4.2 J7.P$1 J6.P$1 R2.1
  Bottom 0.178: v74.8,121.41 75.56,122.17 v77.98,122.17
N$55
  Top 0.254: U1.8 73.96,115.19 R5.1 J8.P$1
N$56
  Bottom 0.178: J36.2 120.73,69.27 120.73,44.27 108.1,31.65 72.03,31.65 66.88,26.49 63.96,26.49 60.58,23.11 60.58,21.21 J93.P$1
N$57
  Bottom 0.178: J36.3 120.37,67.08 120.37,44.45 107.92,32 71.75,32 66.6,26.85 63.68,26.85 J89.P$1
N$58
  Top 0.254: U1.6 76.93,122.14 77.22,122.43 77.22,124.63 C1.1
N$59
  Bottom 0.178: J36.4 120.02,64.9 120.02,44.63 107.75,32.36 70.33,32.36 67,29.03 63.32,29.03 J86.P$1
N$60
  Bottom 0.178: J36.5 119.66,62.71 119.66,44.81 107.57,32.72 70.05,32.72 66.73,29.39 61.14,29.39 J83.P$1
N$61
  Bottom 0.178: J36.6 119.3,60.53 119.3,44.98 107.39,33.07 68.38,33.07 66.88,31.57 60.78,31.57 J80.P$1
N$62
  Bottom 0.178: J36.7 118.95,58.34 118.95,45.16 107.21,33.43 68.1,33.43 66.6,31.93 59.26,31.93 J76.P$1
N$63
  Bottom 0.178: J36.8 118.59,56.16 118.59,45.34 107.04,33.78 68.07,33.78 67.74,34.11 59.61,34.11 J73.P$1
N$64
  Bottom 0.178: J36.9 116.97,54.56 118.24,53.29 118.24,45.52 106.86,34.14 68.35,34.14 68.02,34.47 61.8,34.47 J70.P$1
N$65
  Bottom 0.178: J36.10 116.97,44.78 106.68,34.49 68.76,34.49 66.6,36.65 62.28,36.65 59.05,39.88 J68.P$1
N$68
  Bottom 0.178: J36.20 113.46,51.74 113.46,41.81 106.5,34.85 69.04,34.85 66.88,37.01 64.34,37.01 J67.P$2
N$69
  Bottom 0.178: J36.19 114.43,54.41 113.11,53.09 113.11,41.99 106.32,35.2 70.59,35.2 60.83,44.96 J66.P$2
N$70
  Bottom 0.178: J36.18 112.75,56.11 112.75,42.16 106.15,35.56 70.76,35.56 58.93,47.4 J65.P$2
N$71
  Bottom 0.178: J36.17 112.39,58.29 112.39,42.34 105.97,35.92 70.94,35.92 60.45,46.41 60.45,48.51 J64.P$2
N$72
  Bottom 0.178: J36.16 112.04,60.48 112.04,42.52 105.79,36.27 71.12,36.27 60.81,46.58 60.81,50.7 J60.P$2
N$73
  Bottom 0.178: J36.15 111.68,62.66 111.68,42.7 105.61,36.63 79.3,36.63 60.81,55.12 59.03,55.12 J58.P$2 58.85,55.12
N$74
  Bottom 0.178: J36.14 111.33,64.85 111.33,42.88 105.44,36.98 79.48,36.98 58.93,57.53 J52.P$2
N$75
  Bottom 0.178: J36.13 110.97,67.03 110.97,43.05 105.26,37.34 79.65,37.34 60.1,56.9 60.1,59.03 J48.P$2
N$76
  Bottom 0.178: J36.12 110.62,69.22 110.62,43.23 105.08,37.69 79.83,37.69 60.45,57.07 60.45,61.21 J46.P$2
N$77
  Bottom 0.178: J36.11 110.26,71.4 110.26,43.41 104.9,38.05 80.01,38.05 60.81,57.25 60.81,63.4 J40.P$2
N$78
  Top 0.406: U13.2 117.06,15.24 R21.1 114.34,14.39 J97.P$1
N$79
  Top 0.406: U11.3 120.56,20.92 120.14,21.34 120.14,21.38 | 120.14,21.46 120.14,21.38 | 120.14,21.38 R20.2 120.4,21.63 120.4,21.84 121.54,22.99 122.81,22.99 124.05,21.74 U12.3
N$80
  Top 0.61: J61.P$16 J34.VUNREGULATED
N$81
  Top 0.178: U10.4 41.08,16.72 40.89,16.54 27.96,16.54 R23.P$1
N$82
  Top 0.178: R24.P$2 D5.C
N$83
  Top 0.178: R25.P$2 D6.C
N$84
  Top 0.178: R26.P$2 D7.C
N$85
  Top 0.406: J49.P$1 U7.TX
N$86
  Top 0.406: J47.P$1 U7.RX
N$87
  Top 0.305: U9.2 23.01,29.06 22.61,29.46 22.61,31.5 J74.P$1
N$88
  Top 0.178: R30.P$2 55.42,4.37 D11.C
N$89
  Top 0.178: R29.P$2 D10.C
N$90
  Top 0.305: U9.3 22.39,28.41 21.84,28.96 21.84,29.72 J77.P$1
N$91
  Top 0.305: U9.4 21.27,27.76 J81.P$1
N$92
  Top 0.178: R28.P$2 D9.C
N$93
  Top 0.178: R27.P$2 D8.C
N$94
  Top 0.178: U10.5 41.73,16.66 41.25,16.18 32.18,16.18 R24.P$1
N$95
  Top 0.178: U10.6 42.38,16.77 41.43,15.82 36.4,15.82 R25.P$1
N$96
  Top 0.305: U9.5 21.27,27.11 J84.P$1
N$97
  Top 0.305: U9.6 22.39,26.46 21.84,25.91 21.84,25.15 J87.P$1
N$98
  Top 0.305: U9.7 23.01,25.81 22.61,25.4 22.61,23.37 J90.P$1
N$99
  Top 0.305: U9.8 23.75,21.97 J94.P$1
N$100
  Top 0.254: U6.14 U6.15 31.57,63.83 32.38,64.64 J38.P$1 C16.1
N$101
  Top 0.178: U10.7 43.03,16.71 41.78,15.47 40.62,15.47 R26.P$1
N$102
  Top 0.178: U10.9 43.68,20.33 45.34,18.67 45.34,14.94 46.76,13.51 53.85,13.51 R30.P$1
N$103
  Top 0.254: J55.P$2 26.92,59.27 C19.1 27.59,60.27 U6.8
N$104
  Top 0.178: U10.10 43.03,20.45 44.98,18.49 44.98,14.76 46.58,13.16 49.58,13.16 R29.P$1
N$105
  Top 0.178: U10.11 42.38,20.56 44.63,18.31 44.63,14.58 46.23,12.98 R28.P$1
N$106
  Top 0.178: R8.2 54.19,106.05 57.02,106.05 U3.TAB
  Top 0.406: U3.2 J20.P$2 | 62.23,100.97 U3.TAB
  Top 1.016: U3.2 60.45,100.84 60.96,100.33 61.59,100.33 62.55,101.28
  Top 2.184: C7.+ 66.52,105.26 62.55,101.28 62.23,100.97
N$107
  pour Top: 68.33,94.87 68.33,77.34 56.64,77.34 56.64,82.17 50.04,82.17 50.04,94.87
N$108
  Top 0.178: U10.12 41.73,20.68 44.27,18.14 44.27,14.55 R27.P$1
N$109
  pour Top: 35.56,105.03 35.56,111.89 40.13,111.89 40.13,124.21 20.57,124.21 20.57,105.03
N$110
  Top 0.254: J56.P$2 28.61,58 C20.1 29.01,59.83 U6.10
N$111
  Top 0.254: J57.P$2 32.17,57.32 C21.1 31.03,60.58 30.73,60.58 30.31,61 U6.12
POWER_LIPO+_IN
  pour Top: 100.97,73.66 109.22,73.66 115.57,80.01 115.57,104.14 101.6,104.14 100.97,103.5
POWER_LIPO_POST  (via drill 0.6)
  Top 0.254: R1.1 J5.P$1 80.01,121.92 79.53,121.44 U1.2
  Top 0.61: Q2.8 84.9,112.33 v85.09,112.52
  Top 3.81: Q3.S 103,111.12 99.69,111.12
  Bottom 0.61: v85.09,112.52 85.09,118.36 J5.P$1
  pour Top (rank 3): 82.55,92.96 82.55,116.08 101.35,116.08 101.35,92.96
SCL  (via drill 0.6)
  Top 0.178: 33.02,29.46 36.07,26.42 v37.34,26.42 | v40.39,25.15 40.43,25.11 U10.14
  Top 0.406: U5.2 12.69,53.35 J61.P$15 J34.SCL 15.24,50.8 19.81,50.8 20.32,50.29 20.32,48.77 30.99,38.1 33.02,38.1 | J68.P$2 54.61,38.1 33.02,38.1 | U9.14 31.96,28.41 33.02,29.46 v33.02,36.2 | v33.02,39.22 33.02,38.1
  Bottom 0.178: J85.P$1 63.5,25.4 61.09,22.99 61.09,19.56 59.82,18.29 58.29,18.29 57.84,18.75 57.84,38.43 J68.P$2 | v37.34,26.42 39.12,26.42 v40.39,25.15
  Bottom 0.406: v33.02,36.2 v33.02,39.22
SDA  (via drill 0.6)
  Top 0.178: U10.15 39.78,23.98 v39.12,24.64 | v30.23,30.99 31.37,30.99 31.62,30.73
  Top 0.406: U5.3 14.49,54.09 J61.P$14 | 31.88,37.34 J70.P$2 | U9.15 30.71,29.06 31.62,29.97 31.62,30.73 31.62,37.08 31.88,37.34 | J34.SDA 28.7,37.34 31.88,37.34
  Bottom 0.178: J88.P$1 62.23,22.86 62.1,22.73 62.1,17.4 60.45,15.75 58.04,15.75 57.48,16.31 57.48,36.25 J70.P$2 | v39.12,24.64 38.35,25.4 35.81,25.4 v30.23,30.99
  Bottom 0.406: J61.P$14 J34.SDA
SRX0
  Top 0.406: J37.P$17 J34.UART0_RX 8.89,78.61 9.4,79.12 15.7,79.12 J27.P$2
SRX1
  Top 0.178: J49.P$2 45.34,60.96 45.34,71.75 43.18,73.91 43.18,78.11 42.55,78.74 20.32,78.74 J34.UART1_RX
  Top 0.406: J34.UART1_RX J37.P$13
STX0
  Top 0.406: J37.P$18 J34.UART0_TX 8.76,79.88 14.48,79.88 15.24,80.64 J26.P$2
STX1
  Top 0.178: J47.P$2 47.88,63.5 47.88,65.53 45.85,67.56 45.85,73.91 45.72,74.04 45.72,78.61 45.09,79.25 18.29,79.25 J34.UART1_TX
  Top 0.406: J34.UART1_TX J37.P$14
VMOTOR_A2D  (via drill 0.6)
  Top 0.254: J62.P$1 R16.1 | v82.04,52.07 R17.2
  Bottom 0.254: J62.P$1 v82.04,52.07

### Text on the board
tValues: Headless Chicken Revision A | Logic Power Enable | GND | 3.3V | 3.3V | SCL | SDA | SCL | A2D0_I2C | SDA | A2D1_I2C | A2D2_I2C | A2D3_I2C | A2D4_I2C | Motor Power Enable | A2D5_I2C | A2D6_I2C | A2D7_I2C